# EAGLE design Twin_PLL_GPSDO (EAGLE 6.2)

## Sheet 1 of 3: Interface
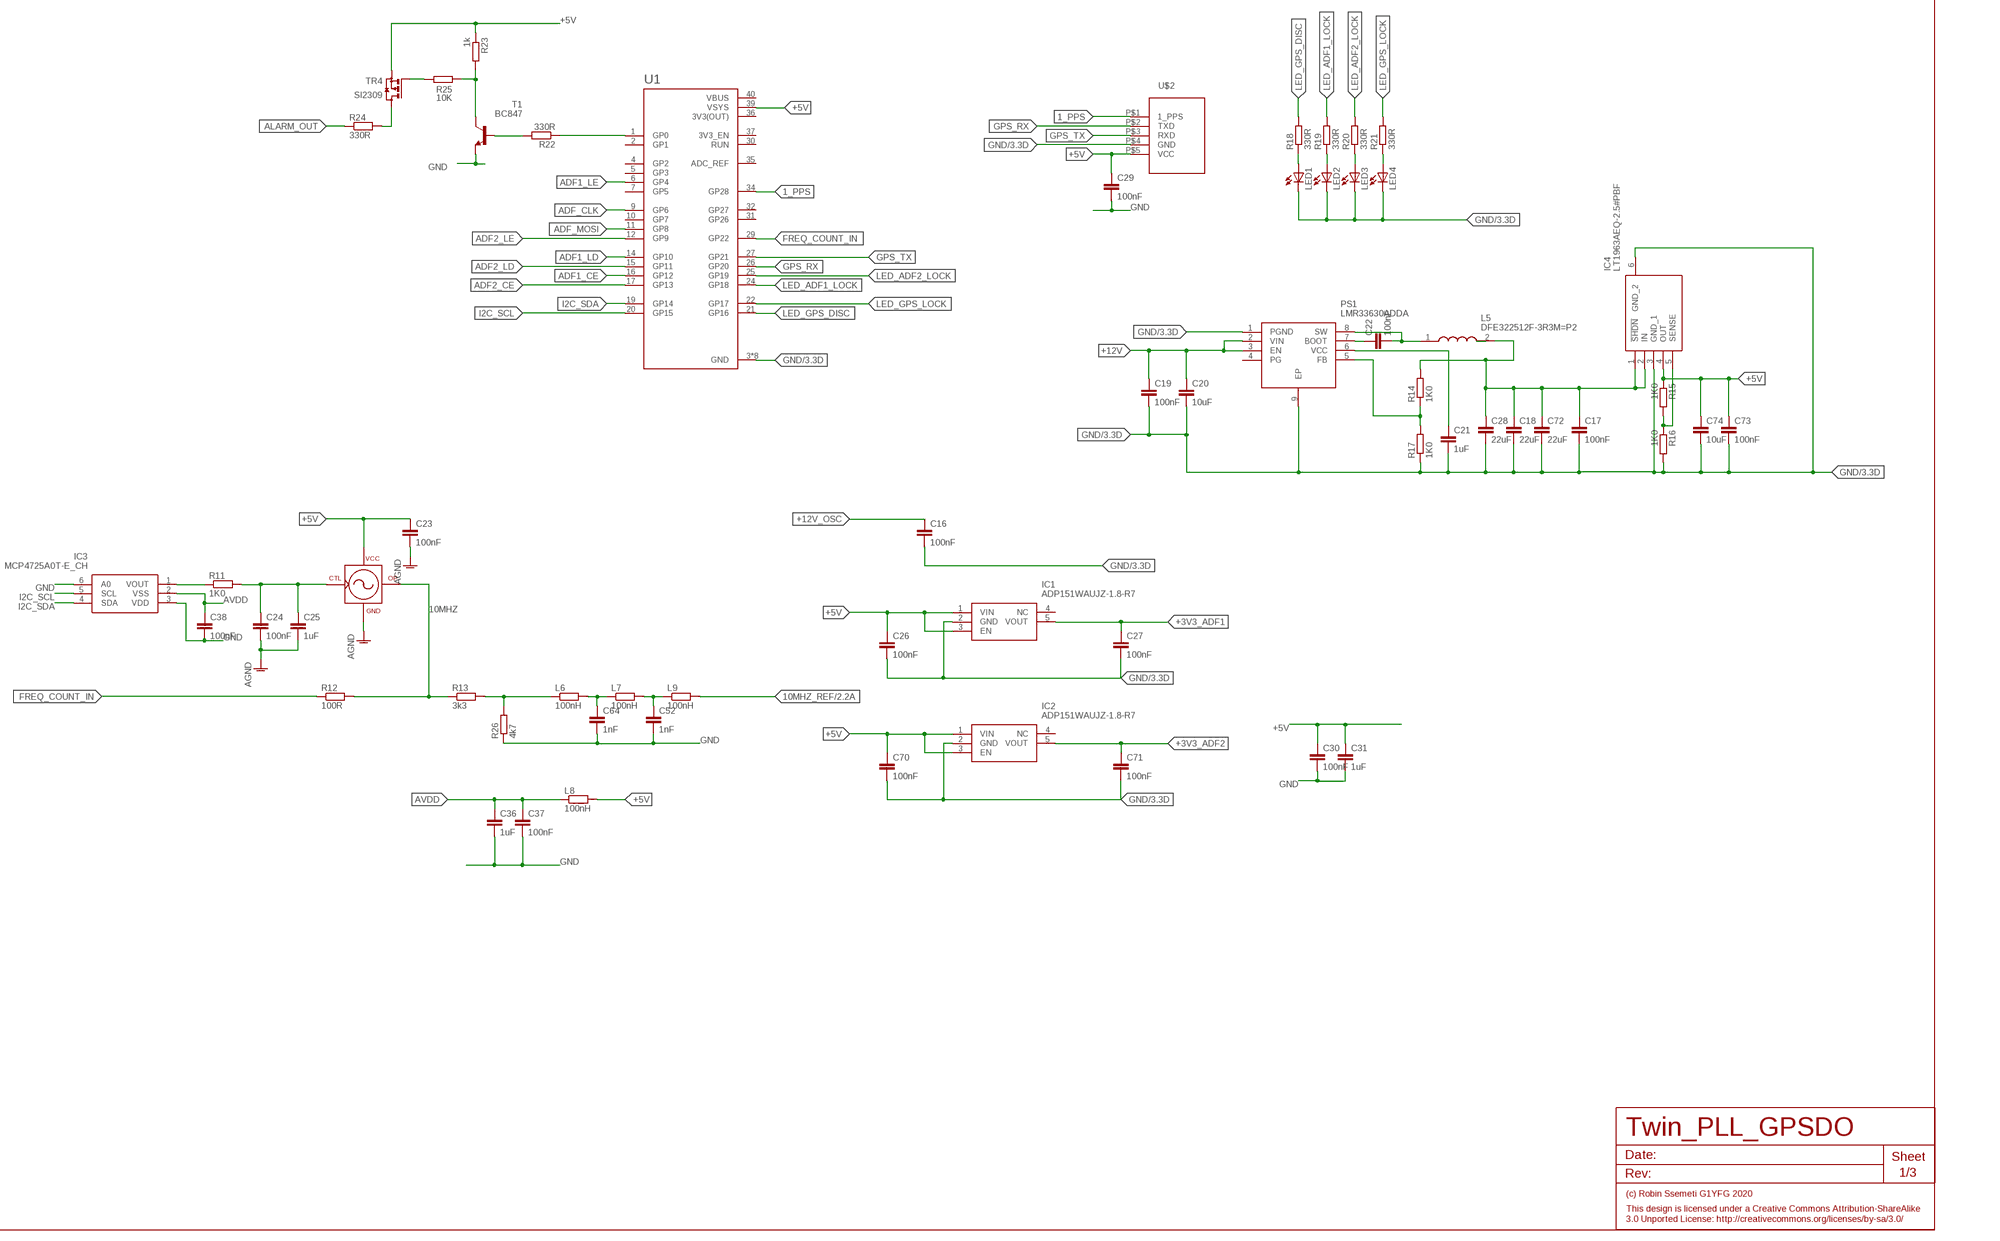
[diagram p0: schematic, sheet 1]

### Parts
C16  100nF  C-EUC0805  [C0805]
C17  100nF  C-EUC0805  [C0805]
C18  22uF  C-EUC1210  [C1210]
C19  100nF  C-EUC0805  [C0805]
C20  10uF  C-EUC0805  [C0805]
C21  1uF  C-EUC0805  [C0805]
C22  100nF  C-EUC0805  [C0805]
C23  100nF  C-EUC0603  [C0603]
C24  100nF  C-EUC0603  [C0603]
C25  1uF  C-EUC0603  [C0603]
C26  100nF  C-EUC0805  [C0805]
C27  100nF  C-EUC0805  [C0805]
C28  22uF  C-EUC1210  [C1210]
C29  100nF  C-EUC0805  [C0805]
C30  100nF  C-EUC0603  [C0603]
C31  1uF  C-EUC0603  [C0603]
C36  1uF  C-EUC0603  [C0603]
C37  100nF  C-EUC0603  [C0603]
C38  100nF  C-EUC0603  [C0603]
C52  1nF  C-EUC0603  [C0603]
C64  1nF  C-EUC0603  [C0603]
C70  100nF  C-EUC0805  [C0805]
C71  100nF  C-EUC0805  [C0805]
C72  22uF  C-EUC1210  [C1210]
C73  100nF  C-EUC0805  [C0805]
C74  10uF  C-EUC0805  [C0805]
IC1  ADP151WAUJZ-1.8-R7  [SOT95P280X100-5N]
IC2  ADP151WAUJZ-1.8-R7  [SOT95P280X100-5N]
IC3  MCP4725A0T-E_CH  [SOT95P270X145-6N]
IC4  LT1963AEQ-2.5#PBF  [LT1963AEQ25PBF]
L5  DFE322512F-3R3M=P2  [1277ASH100MP2]
L6  100nH  R-EU_R0603  [R0603]
L7  100nH  R-EU_R0603  [R0603]
L8  100nH  R-EU_R0603  [R0603]
L9  100nH  R-EU_R0603  [R0603]
LED1  LEDCHIPLED_0603  [CHIPLED_0603]
LED2  LEDCHIPLED_0603  [CHIPLED_0603]
LED3  LEDCHIPLED_0603  [CHIPLED_0603]
LED4  LEDCHIPLED_0603  [CHIPLED_0603]
OSC1  CTI_OSC  [CTI_OSC]
PS1  LMR33630ADDA  [SOIC127P600X170-9N]
R11  1K0  R-EU_R0805  [R0805]
R12  100R  R-EU_R0805  [R0805]
R13  3k3  R-EU_R0603  [R0603]
R14  1K0  R-EU_R0805  [R0805]
R15  1K0  R-EU_R0805  [R0805]
R16  1K0  R-EU_R0805  [R0805]
R17  1K0  R-EU_R0805  [R0805]
R18  330R  R-EU_R0603  [R0603]
R19  330R  R-EU_R0603  [R0603]
R20  330R  R-EU_R0603  [R0603]
R21  330R  R-EU_R0603  [R0603]
R22  330R  R-EU_R0603  [R0603]
R23  1k  R-EU_R0603  [R0603]
R24  330R  R-EU_R0805  [R0805]
R25  10K  R-EU_R0805  [R0805]
R26  4k7  R-EU_R0603  [R0603]
T1  BC847  [SOT23]
TR4  SI2309  BSS84  [SOT23]
U1  RASPBERRY_PICO-NO_DEBUGTH  [PICO-PKG-TH-STD]
U$2  GPS  [GPS]

### Nets
1_PPS: U1.34(GP28) U$2.P$1(1_PPS)
10MHZ: OSC1.OUT(OP) R12.2 R13.1
10MHZ_REF: L9.2 ; also sheet 2,3
+3V3_ADF1: C27.1 IC1.5(VOUT) ; also sheet 2
+3V3_ADF2: C71.1 IC2.5(VOUT) ; also sheet 3
+5V: C23.1 C26.1 C29.1 C30.1 C31.1 C70.1 C73.1 C74.1 IC1.1(VIN) IC1.3(EN) IC2.1(VIN) IC2.3(EN) IC4.4(OUT) L8.2 OSC1.VCC R15.1 R23.1 TR4.2(S) U1.39(VSYS) U$2.P$5(VCC)
+12V: C19.1 C20.1 PS1.2(VIN) PS1.3(EN)
+12V_OSC [PWR]: C16.1
ADF1_CE: U1.16(GP12) ; also sheet 2
ADF1_LD: U1.14(GP10) ; also sheet 2
ADF1_LE: U1.6(GP4) ; also sheet 2
ADF2_CE: U1.17(GP13) ; also sheet 3
ADF2_LD: U1.15(GP11) ; also sheet 3
ADF2_LE: U1.12(GP9) ; also sheet 3
ADF_CLK: U1.9(GP6) ; also sheet 2,3
ADF_MOSI: U1.11(GP8) ; also sheet 2,3
ALARM_OUT: R24.1
ALARM_PIN: R22.1 U1.1(GP0)
AVDD: C36.1 C37.1 C38.1 IC3.2(VSS) L8.1
FREQ_COUNT_IN: R12.1 U1.29(GP22)
GND: C16.2 C17.2 C18.2 C19.2 C20.2 C21.2 C23.2 C24.2 C25.2 C26.2 C27.2 C28.2 C29.2 C30.2 C31.2 C36.2 C37.2 C38.2 C52.2 C64.2 C70.2 C71.2 C72.2 C73.2 C74.2 IC1.2(GND) IC2.2(GND) IC3.3(VDD) IC3.6(A0) IC4.3(GND_1) IC4.6(GND_2) LED1.C LED2.C LED3.C LED4.C OSC1.GND PS1.1(PGND) PS1.9(EP) R16.2 R17.1 R26.1 T1.2(E) U1.3(GND) U1.8(GND) U1.13(GND) U1.18(GND) U1.23(GND) U1.28(GND) U1.33(GND) U1.38(GND) U$2.P$4(GND) ; supply symbol labelled AGND ; also sheet 2,3
GPS_RX: U1.26(GP20) U$2.P$2(TXD)
GPS_TX: U1.27(GP21) U$2.P$3(RXD)
I2C_SCL: IC3.5(SCL) U1.20(GP15)
I2C_SDA: IC3.4(SDA) U1.19(GP14)
LED_ADF1_LOCK: R19.2 U1.24(GP18)
LED_ADF2_LOCK: R20.2 U1.25(GP19)
LED_GPS_DISC: R18.2 U1.21(GP16)
LED_GPS_LOCK: R21.2 U1.22(GP17)
N$20: IC3.1(VOUT) R11.1
N$21: R23.2 R25.2 T1.3(C)
N$26: L6.1 R13.2 R26.2
N$27: LED1.A R18.1
N$28: R22.2 T1.1(B)
N$29: IC4.5(SENSE) R15.2 R16.1
N$31: PS1.5(FB) R14.1 R17.2
N$32: C24.1 C25.1 OSC1.REF(CTRL) R11.2
N$33: C21.1 PS1.6(VCC)
N$34: C22.1 PS1.7(BOOT)
N$35: C22.2 L5.1 PS1.8(SW)
N$36: C17.1 C18.1 C28.1 C72.1 IC4.1(!SHDN) IC4.2(IN) L5.2 R14.2
N$37: LED2.A R19.1
N$38: LED3.A R20.1
N$39: LED4.A R21.1
N$41: C64.1 L6.2 L7.1
N$42: R25.1 TR4.1(G)
N$43: C52.1 L7.2 L9.1
SWITCH: R24.2 TR4.3(D)
Unconnected: IC1.4(NC) IC2.4(NC) PS1.4(PG) U1.2(GP1) U1.4(GP2) U1.5(GP3) U1.7(GP5) U1.10(GP7) U1.30(RUN) U1.31(GP26) U1.32(GP27) U1.35(ADC_REF) U1.37(3V3_EN)

## Sheet 2 of 3
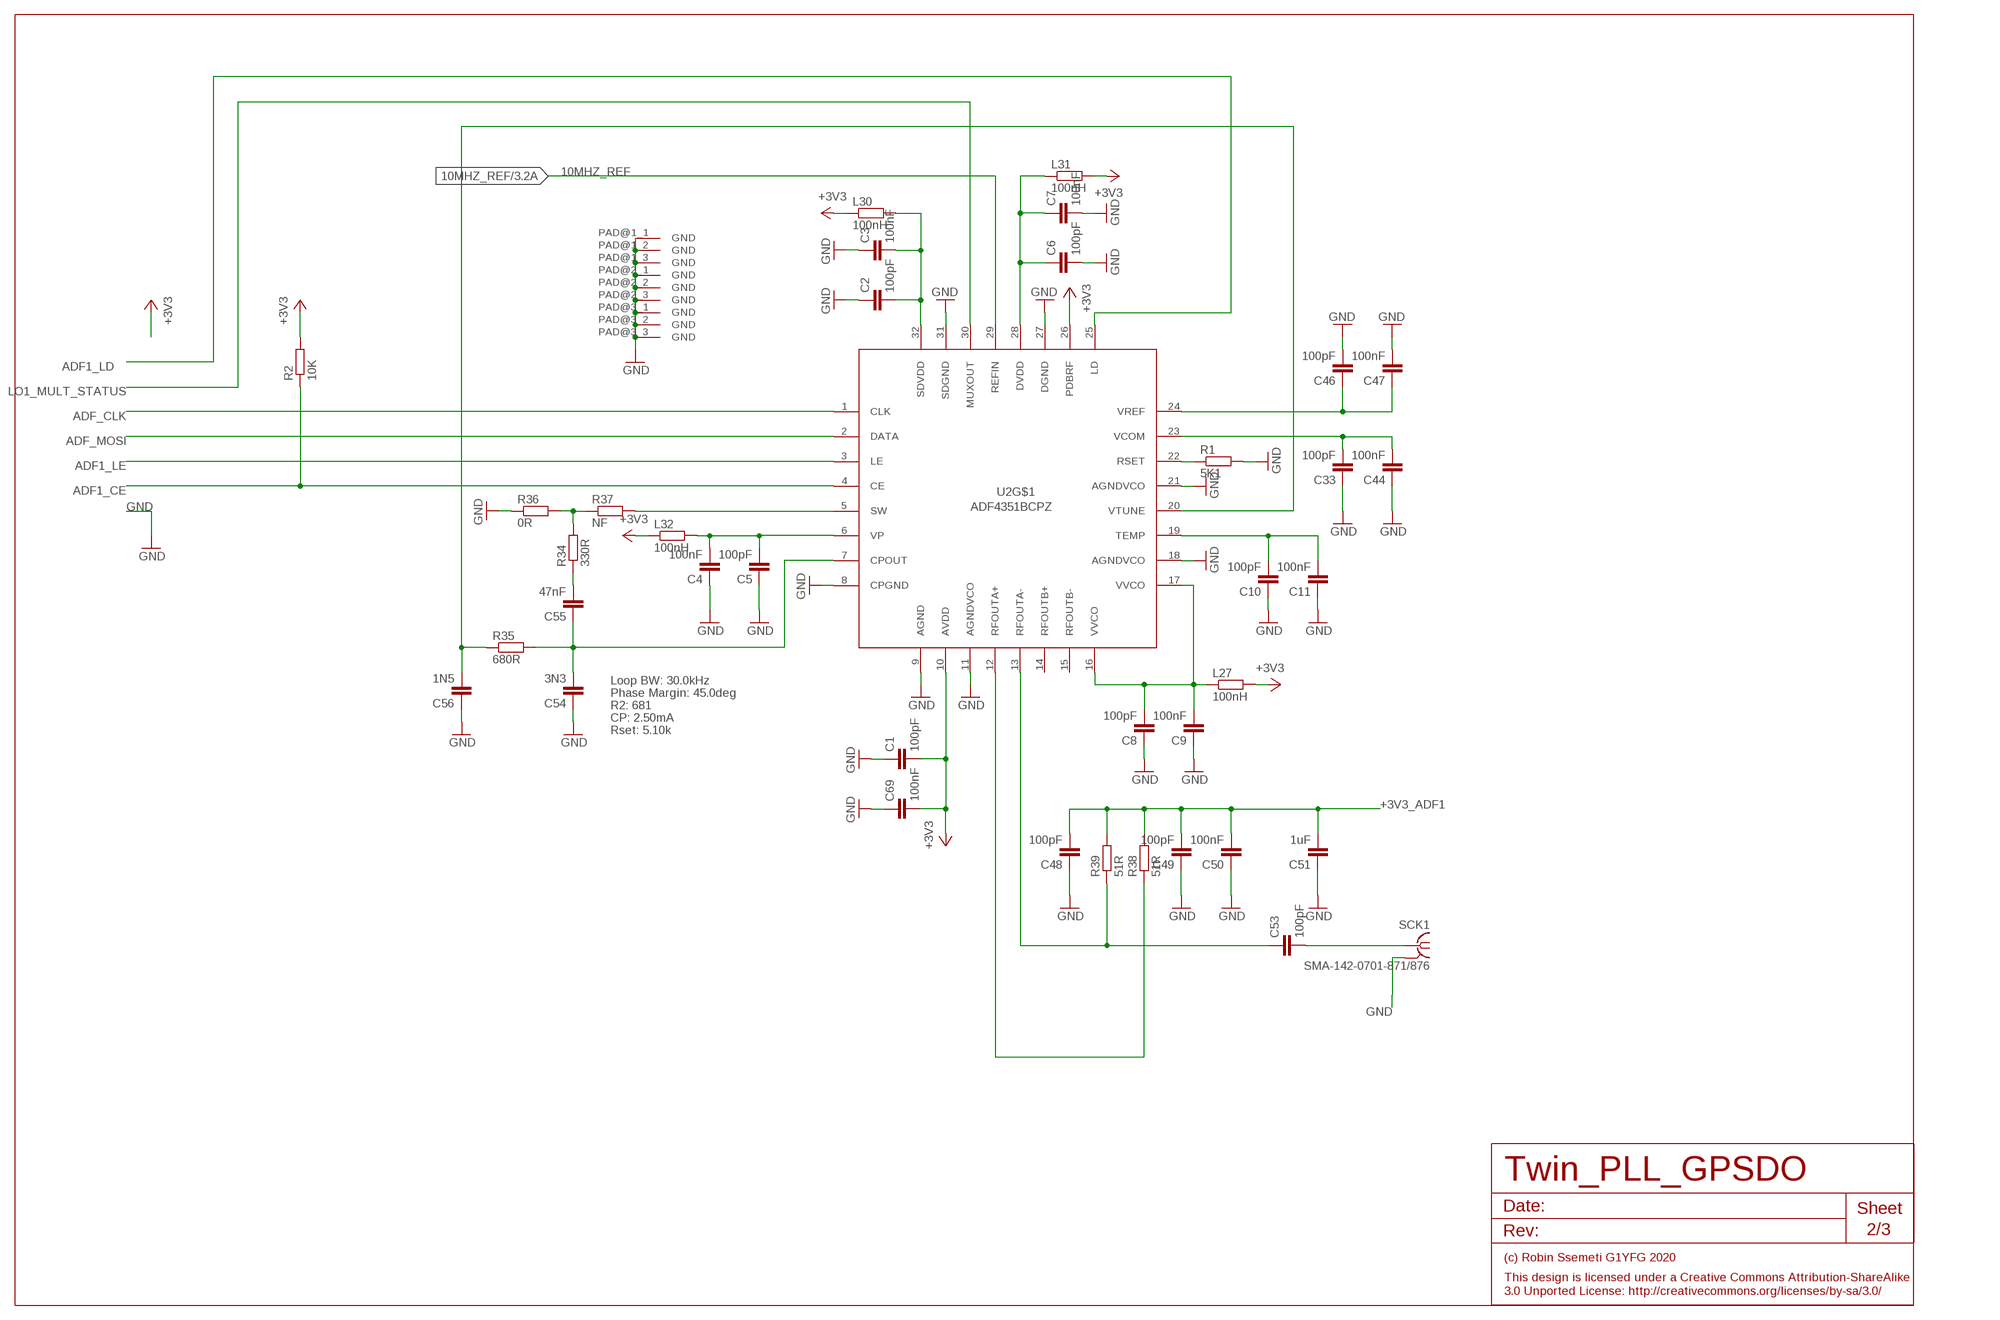
[diagram p1: schematic, sheet 2]

### Parts
C1  100pF  C-EUC0603  [C0603]
C2  100pF  C-EUC0603  [C0603]
C3  100nF  C-EUC0603  [C0603]
C4  100nF  C-EUC0603  [C0603]
C5  100pF  C-EUC0603  [C0603]
C6  100pF  C-EUC0603  [C0603]
C7  100nF  C-EUC0603  [C0603]
C8  100pF  C-EUC0603  [C0603]
C9  100nF  C-EUC0603  [C0603]
C10  100pF  C-EUC0603  [C0603]
C11  100nF  C-EUC0603  [C0603]
C33  100pF  C-EUC0603  [C0603]
C44  100nF  C-EUC0603  [C0603]
C46  100pF  C-EUC0603  [C0603]
C47  100nF  C-EUC0603  [C0603]
C48  100pF  C-EUC0603  [C0603]
C49  100pF  C-EUC0603  [C0603]
C50  100nF  C-EUC0603  [C0603]
C51  1uF  C-EUC0603  [C0603]
C53  100pF  C-EUC0603  [C0603]
C54  3N3  C-EUC0603  [C0603]
C55  47nF  C-EUC0603  [C0603]
C56  1N5  C-EUC0603  [C0603]
C69  100nF  C-EUC0603  [C0603]
L27  100nH  R-EU_R0603  [R0603]
L30  100nH  R-EU_R0603  [R0603]
L31  100nH  R-EU_R0603  [R0603]
L32  100nH  R-EU_R0603  [R0603]
R1  5K1  R-EU_R0603  [R0603]
R2  10K  R-EU_R0603  [R0603]
R34  330R  R-EU_R0603  [R0603]
R35  680R  R-EU_R0603  [R0603]
R36  0R  R-EU_R0603  [R0603]
R37  NF  R-EU_R0603  [R0603]
R38  51R  R-EU_R0603  [R0603]
R39  51R  R-EU_R0603  [R0603]
SCK1  SMA-142-0701-871/876  [J502-ND-142-0701-871/876]
U2  ADF4351BCPZ  ADF4350BCPZ  [QFN50P500X500X100-33V2N]

### Nets
10MHZ_REF: U2.29(REFIN) ; also sheet 1,3
+3V3_ADF1: C1.2 C48.2 C49.2 C50.2 C51.2 C69.2 L27.2 L30.1 L31.2 L32.1 R2.2 R38.2 R39.2 U2.10(AVDD) U2.26(PDBRF) ; supply symbol labelled +3V3 ; also sheet 1
ADF1_CE: R2.1 U2.4(CE) ; also sheet 1
ADF1_LD: U2.25(LD) ; also sheet 1
ADF1_LE: U2.3(LE) ; also sheet 1
ADF_CLK: U2.1(CLK) ; also sheet 1,3
ADF_MOSI: U2.2(DATA) ; also sheet 1,3
GND: C1.1 C2.1 C3.1 C4.1 C5.1 C6.2 C7.2 C8.1 C9.1 C10.1 C11.1 C33.1 C44.1 C46.2 C47.2 C48.1 C49.1 C50.1 C51.1 C54.1 C56.1 C69.1 R1.2 R36.1 SCK1.G@1(GND) U2.8(CPGND) U2.9(AGND) U2.11(AGNDVCO) U2.18(AGNDVCO) U2.21(AGNDVCO) U2.27(DGND) U2.31(SDGND) U2.PAD@1_1(GND) U2.PAD@1_2(GND) U2.PAD@1_3(GND) U2.PAD@2_1(GND) U2.PAD@2_2(GND) U2.PAD@2_3(GND) U2.PAD@3_1(GND) U2.PAD@3_2(GND) U2.PAD@3_3(GND) ; also sheet 1,3
LO1_MULT_STATUS: U2.30(MUXOUT)
N$2: C10.2 C11.2 U2.19(TEMP)
N$4: C33.2 C44.2 U2.23(VCOM)
N$8: C46.1 C47.1 U2.24(VREF)
N$13: C4.2 C5.2 L32.2 U2.6(VP)
N$14: C2.2 C3.2 L30.2 U2.32(SDVDD)
N$17: R1.1 U2.22(RSET)
N$18: R38.1 U2.12(RFOUTA+)
N$19: C53.1 R39.1 U2.13(RFOUTA-)
N$46: C54.2 C55.1 R35.2 U2.7(CPOUT)
N$47: C56.2 R35.1 U2.20(VTUNE)
N$48: C55.2 R34.1
N$49: R34.2 R36.2 R37.1
N$50: R37.2 U2.5(SW)
N$73: C6.1 C7.1 L31.1 U2.28(DVDD)
N$78: C8.2 C9.2 L27.1 U2.16(VVCO) U2.17(VVCO)
N$101 [50ohm]: C53.2 SCK1.1
Unconnected: U2.14(RFOUTB+) U2.15(RFOUTB-)

### Notes on the sheet
- Loop BW: 30.0kHz
- Phase Margin: 45.0deg
- R2: 681
- CP: 2.50mA
- Rset: 5.10k

## Sheet 3 of 3
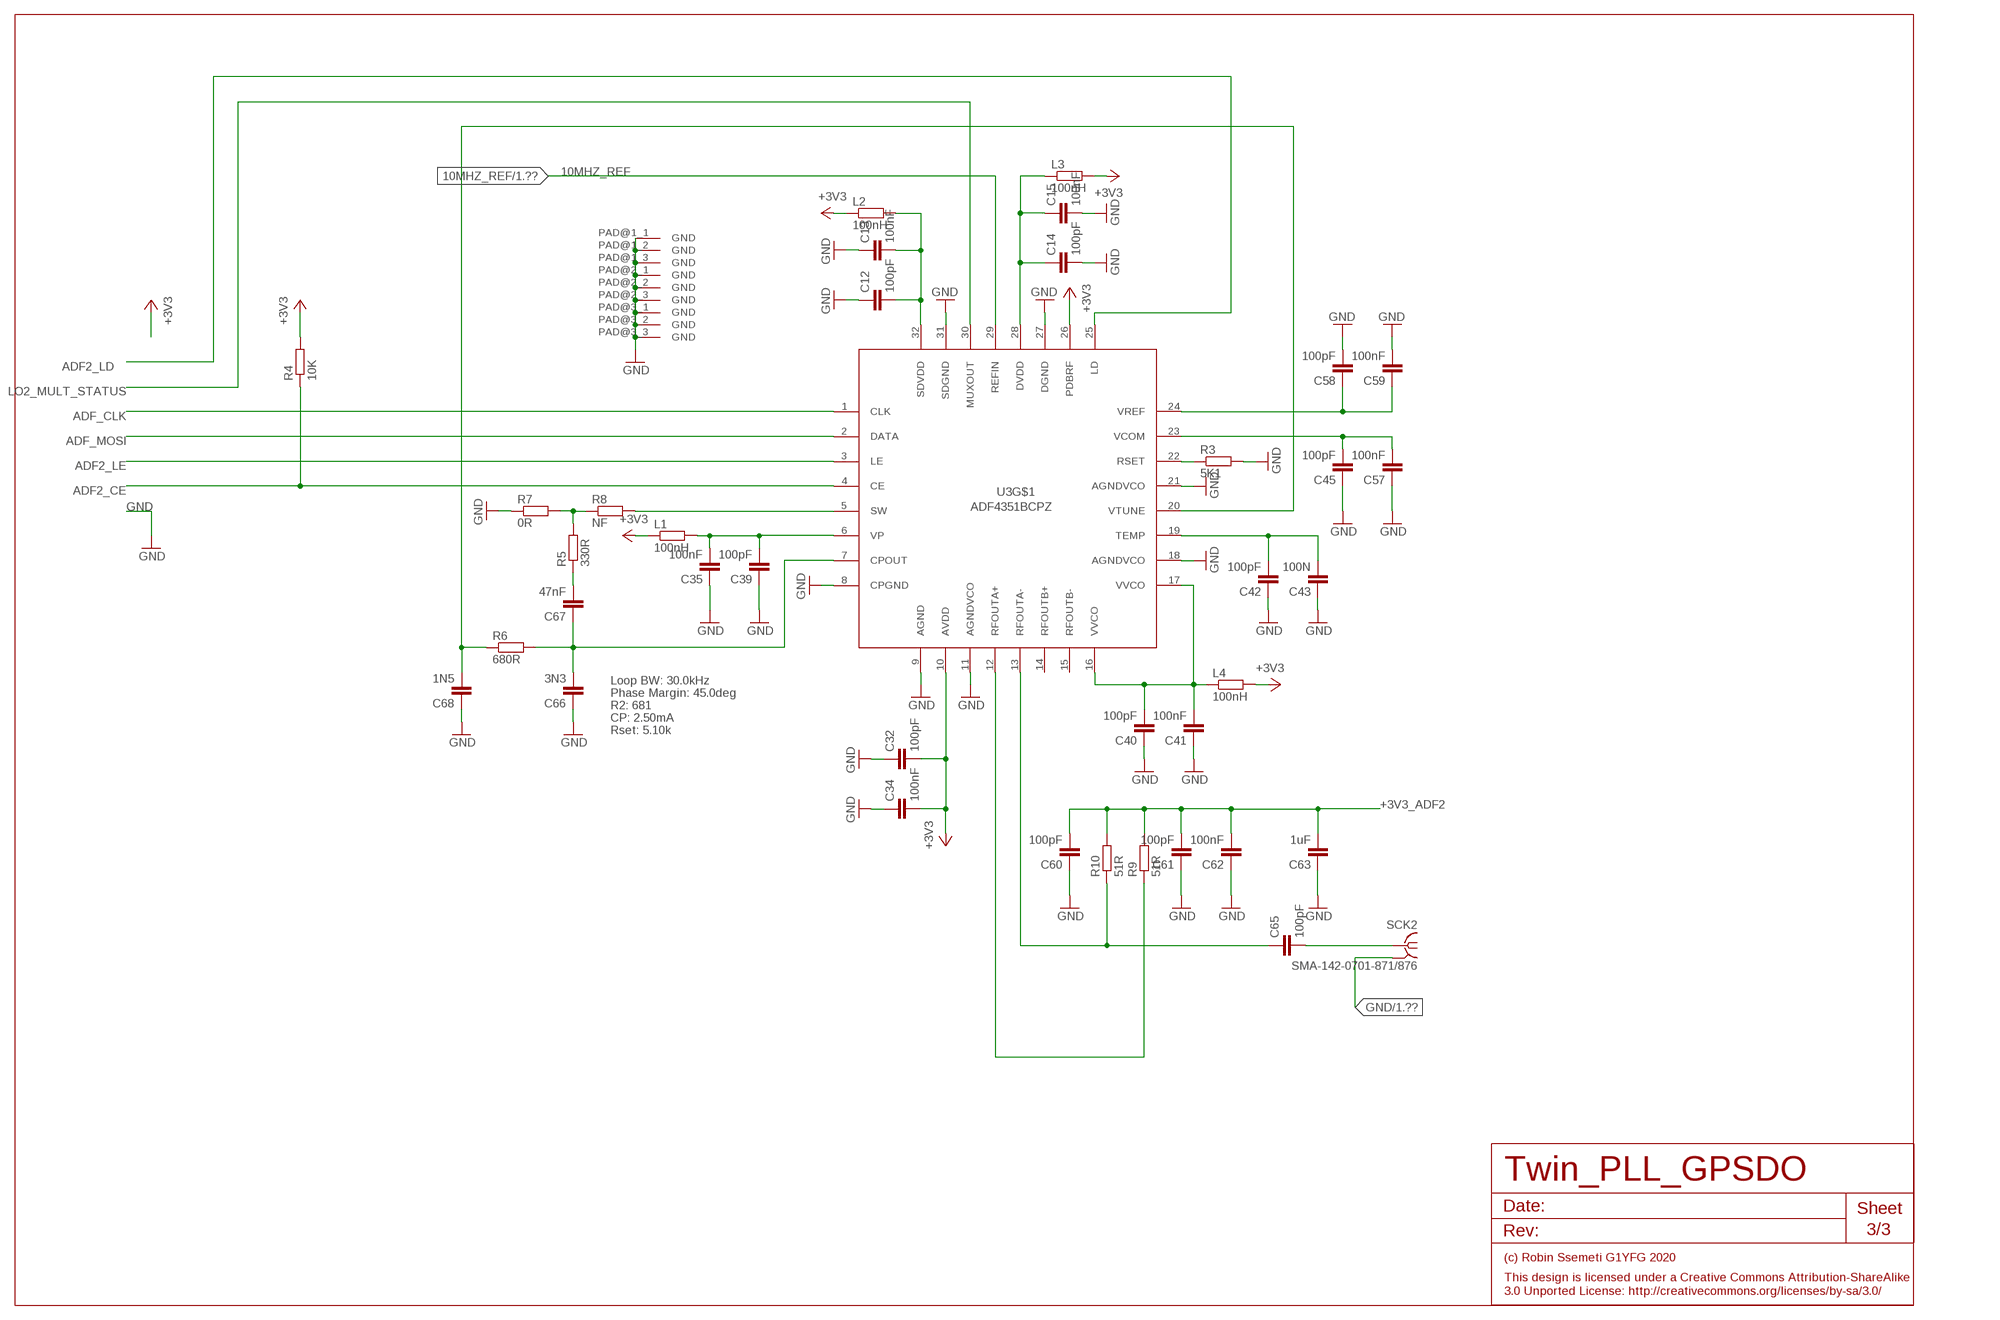
[diagram p2: schematic, sheet 3]

### Parts
C12  100pF  C-EUC0603  [C0603]
C13  100nF  C-EUC0603  [C0603]
C14  100pF  C-EUC0603  [C0603]
C15  100nF  C-EUC0603  [C0603]
C32  100pF  C-EUC0603  [C0603]
C34  100nF  C-EUC0603  [C0603]
C35  100nF  C-EUC0603  [C0603]
C39  100pF  C-EUC0603  [C0603]
C40  100pF  C-EUC0603  [C0603]
C41  100nF  C-EUC0603  [C0603]
C42  100pF  C-EUC0603  [C0603]
C43  100N  C-EUC0603  [C0603]
C45  100pF  C-EUC0603  [C0603]
C57  100nF  C-EUC0603  [C0603]
C58  100pF  C-EUC0603  [C0603]
C59  100nF  C-EUC0603  [C0603]
C60  100pF  C-EUC0603  [C0603]
C61  100pF  C-EUC0603  [C0603]
C62  100nF  C-EUC0603  [C0603]
C63  1uF  C-EUC0603  [C0603]
C65  100pF  C-EUC0603  [C0603]
C66  3N3  C-EUC0603  [C0603]
C67  47nF  C-EUC0603  [C0603]
C68  1N5  C-EUC0603  [C0603]
L1  100nH  R-EU_R0603  [R0603]
L2  100nH  R-EU_R0603  [R0603]
L3  100nH  R-EU_R0603  [R0603]
L4  100nH  R-EU_R0603  [R0603]
R3  5K1  R-EU_R0603  [R0603]
R4  10K  R-EU_R0603  [R0603]
R5  330R  R-EU_R0603  [R0603]
R6  680R  R-EU_R0603  [R0603]
R7  0R  R-EU_R0603  [R0603]
R8  NF  R-EU_R0603  [R0603]
R9  51R  R-EU_R0603  [R0603]
R10  51R  R-EU_R0603  [R0603]
SCK2  SMA-142-0701-871/876  [J502-ND-142-0701-871/876]
U3  ADF4351BCPZ  ADF4350BCPZ  [QFN50P500X500X100-33V2N]

### Nets
10MHZ_REF: U3.29(REFIN) ; also sheet 1,2
+3V3_ADF2: C32.2 C34.2 C60.2 C61.2 C62.2 C63.2 L1.1 L2.1 L3.2 L4.2 R4.2 R9.2 R10.2 U3.10(AVDD) U3.26(PDBRF) ; supply symbol labelled +3V3 ; also sheet 1
ADF2_CE: R4.1 U3.4(CE) ; also sheet 1
ADF2_LD: U3.25(LD) ; also sheet 1
ADF2_LE: U3.3(LE) ; also sheet 1
ADF_CLK: U3.1(CLK) ; also sheet 1,2
ADF_MOSI: U3.2(DATA) ; also sheet 1,2
GND: C12.1 C13.1 C14.2 C15.2 C32.1 C34.1 C35.1 C39.1 C40.1 C41.1 C42.1 C43.1 C45.1 C57.1 C58.2 C59.2 C60.1 C61.1 C62.1 C63.1 C66.1 C68.1 R3.2 R7.1 SCK2.G@1(GND) U3.8(CPGND) U3.9(AGND) U3.11(AGNDVCO) U3.18(AGNDVCO) U3.21(AGNDVCO) U3.27(DGND) U3.31(SDGND) U3.PAD@1_1(GND) U3.PAD@1_2(GND) U3.PAD@1_3(GND) U3.PAD@2_1(GND) U3.PAD@2_2(GND) U3.PAD@2_3(GND) U3.PAD@3_1(GND) U3.PAD@3_2(GND) U3.PAD@3_3(GND) ; also sheet 1,2
LO2_MULT_STATUS: U3.30(MUXOUT)
N$1: C42.2 C43.2 U3.19(TEMP)
N$3: C45.2 C57.2 U3.23(VCOM)
N$5: C58.1 C59.1 U3.24(VREF)
N$6: R3.1 U3.22(RSET)
N$7: R9.1 U3.12(RFOUTA+)
N$9: C65.1 R10.1 U3.13(RFOUTA-)
N$10: C66.2 C67.1 R6.2 U3.7(CPOUT)
N$11: C68.2 R6.1 U3.20(VTUNE)
N$12: C67.2 R5.1
N$15: R5.2 R7.2 R8.1
N$16: R8.2 U3.5(SW)
N$22: C35.2 C39.2 L1.2 U3.6(VP)
N$23: C12.2 C13.2 L2.2 U3.32(SDVDD)
N$24: C14.1 C15.1 L3.1 U3.28(DVDD)
N$25: C40.2 C41.2 L4.1 U3.16(VVCO) U3.17(VVCO)
OUTPUT: C65.2 SCK2.1
Unconnected: U3.14(RFOUTB+) U3.15(RFOUTB-)

### Notes on the sheet
- Loop BW: 30.0kHz
- Phase Margin: 45.0deg
- R2: 681
- CP: 2.50mA
- Rset: 5.10k

## Power pins joined to a net without a drawn wire
3V3(OUT): U1.36(3V3(OUT))
GND: SCK1.G@2(GND) SCK1.G@3(GND) SCK1.G@4(GND) SCK2.G@2(GND) SCK2.G@3(GND) SCK2.G@4(GND)
VBUS: U1.40(VBUS)

## Library data of the parts
C1-C17 C19-C27 C29 C32-C35 C38-C51 C53-C63 C65-C71 C73 C74 = rcl:C-EU: CAPACITOR, European symbol
C18 C28 C30 C31 C36 C37 C52 C64 C72 = resistor:C-EU: CAPACITOR, European symbol
IC1 IC2 = ADP151WAUJZ-1.8-R7:ADP151WAUJZ-1.8-R7: LDO Voltage Regulators Ultra-Low Noise 200mA LDO Source: Datasheet <https://www.analog.com/media/en/technical-documentation/data-sheets/adp151.pdf>; DESCRIPTION: LDO Voltage Regulators Ultra-Low Noise 200mA LDO; HEIGHT: 1mm; MANUFACTURER_NAME: Analog Devices; MANUFACTURER_PART_NUMBER: ADP151WAUJZ-1.8-R7; MOUSER_PART_NUMBER: 584-P151WAUJZ-1.8-R7; MOUSER_PRICE-STOCK: https://www.mouser.co.uk/ProductDetail/Analog-Devices/ADP151WAUJZ-1.8-R7?qs=pUKx8fyJudBq6xBHJodQww%3D%3D
IC3 = MCP4725A0T-E_CH:MCP4725A0T-E_CH: D/A Converter 12-Bit EEPROM I2C SOT23-6 Source: Datasheet <http://ww1.microchip.com/downloads/en/DeviceDoc/22039d.pdf>; DESCRIPTION: D/A Converter 12-Bit EEPROM I2C SOT23-6; HEIGHT: 1.45mm; MANUFACTURER_NAME: Microchip; MANUFACTURER_PART_NUMBER: MCP4725A0T-E/CH; MOUSER_PART_NUMBER: 579-MCP4725A0TECH; MOUSER_PRICE-STOCK: https://www.mouser.co.uk/ProductDetail/Microchip-Technology/MCP4725A0T-E-CH?qs=vkMqrgFpRajeQECZ3goc0A%3D%3D
IC4 = LT1963AEQ-2.5#PBF:LT1963AEQ-2.5#PBF: LDO Voltage Regulators Fast Transient 1.5A LDO Source: Datasheet <https://www.analog.com/media/en/technical-documentation/data-sheets/1963aff.pdf>; ARROW_PART_NUMBER: LT1963AEQ-2.5#PBF; ARROW_PRICE-STOCK: https://www.arrow.com/en/products/lt1963aeq-2.5pbf/analog-devices?region=nac; DESCRIPTION: LDO Voltage Regulators Fast Transient 1.5A LDO; HEIGHT: 4.877mm; MANUFACTURER_NAME: Analog Devices; MANUFACTURER_PART_NUMBER: LT1963AEQ-2.5#PBF; MOUSER_PART_NUMBER: 584-LT1963AEQ-2.5PBF; MOUSER_PRICE-STOCK: https://www.mouser.co.uk/ProductDetail/Analog-Devices/LT1963AEQ-2.5PBF?qs=ytflclh7QUVL4eYkr0WUyA%3D%3D
L1-L4 L27 L30-L32 R1 R3 R5 R7 R8 R34 R36 R37 = rcl:R-EU_: RESISTOR, European symbol
L5 = DFE322512F-3R3M=P2:DFE322512F-3R3M=P2: DFE322512F Series Inductor 3.3uH +/-20% 1210 (3225) Source: Datasheet <https://search.murata.co.jp/Ceramy/image/img/P02/J(E)TE243A-0019.pdf>; ARROW_PART_NUMBER: DFE322512F-3R3M=P2; ARROW_PRICE-STOCK: https://www.arrow.com/en/products/dfe322512f-3r3mp2/murata-manufacturing?utm_currency=USD&region=nac; DESCRIPTION: DFE322512F Series Inductor 3.3uH +/-20% 1210 (3225); FARNELL_OC: 2871467; HEIGHT: 1.2mm; MANUFACTURER_NAME: Murata Electronics; MANUFACTURER_PART_NUMBER: DFE322512F-3R3M=P2; MOUSER_PART_NUMBER: 81-DFE322512F-3R3MP2; MOUSER_PRICE-STOCK: https://www.mouser.co.uk/ProductDetail/Murata-Electronics/DFE322512F-3R3M%3dP2?qs=AQlKX63v8Rs49LX98%2FUyBA%3D%3D
L6-L9 R2 R4 R6 R9-R24 R26 R35 R38 R39 = resistor:R-EU_: RESISTOR, European symbol
LED1-LED4 = led:LED: LED OSRAM: - CHIPLED LG R971, LG N971, LY N971, LG Q971, LY Q971, LO R971, LY R971 LH N974, LH R974 LS Q976, LO Q976, LY Q976 LO Q996 - Hyper CHIPLED LW Q18S LB Q993, LB Q99A, LB R99A - SideLED LS A670, LO A670, LY A670, LG A670, LP A670 LB A673, LV A673, LT A673, LW A673 LH A674 LY A675 LS A676, LA A676, LO A676, LY A676, LW A676 LS A679, LY A679, LG A679 - Hyper Micro SIDELED® LS Y876, LA Y876, LO Y876, LY Y876 LT Y87S - SmartLED LW L88C, LW L88S LB L89C, LB L89S, LG L890 LS L89K, LO L89K, LY L89K LS L896, LA L896, LO L896, LY L896 - TOPLED LS T670, LO T670, LY T670, LG T670, LP T670 LSG T670, LSP T670, LSY T670, LOP T670, LYG T670 LG T671, LOG T671, LSG T671 LB T673, LV T673, LT T673, LW T673 LH T674 LS T676, LA T676, LO T676, LY T676, LB T676, LH T676, LSB T676, LW T676 LB T67C, LV T67C, LT T67C, LS T67K, LO T67K, LY T67K, LW E67C LS E67B, LA E67B, LO E67B, LY E67B, LB E67C, LV E67C, LT E67C LW T67C LS T679, LY T679, LG T679 LS T770, LO T770, LY T770, LG T770, LP T770 LB T773, LV T773, LT T773, LW T773 LH T774 LS E675, LA E675, LY E675, LS T675 LS T776, LA T776, LO T776, LY T776, LB T776 LHGB T686 LT T68C, LB T68C - Hyper Mini TOPLED® LB M676 - Mini TOPLED Santana® LG M470 LS M47K, LO M47K, LY M47K Source: http://www.osram.convergy.de LUXEON: - LUMILED® LXK2-PW12-R00, LXK2-PW12-S00, LXK2-PW14-U00, LXK2-PW14-V00 LXK2-PM12-R00, LXK2-PM12-S00, LXK2-PM14-U00 LXK2-PE12-Q00, LXK2-PE12-R00, LXK2-PE12-S00, LXK2-PE14-T00, LXK2-PE14-U00 LXK2-PB12-K00, LXK2-PB12-L00, LXK2-PB12-M00, LXK2-PB14-N00, LXK2-PB14-P00, LXK2-PB14-Q00 LXK2-PR12-L00, LXK2-PR12-M00, LXK2-PR14-Q00, LXK2-PR14-R00 LXK2-PD12-Q00, LXK2-PD12-R00, LXK2-PD12-S00 LXK2-PH12-R00, LXK2-PH12-S00 LXK2-PL12-P00, LXK2-PL12-Q00, LXK2-PL12-R00 Source: www.luxeon.com KINGBRIGHT: KA-3528ASYC Source: www.kingbright.com
OSC1 = RF:CTI_OSC
PS1 = LMR33630ADDA:LMR33630ADDA: SIMPLE SWITCHER 3.8V to 36V, 3A Synchronous Buck Converter With Ultra-Low EMI Source: Datasheet <http://www.ti.com/lit/ds/symlink/lmr33630.pdf>; ARROW_PART_NUMBER: LMR33630ADDA; ARROW_PRICE-STOCK: https://www.arrow.com/en/products/lmr33630adda/texas-instruments.html?utm_currency=USD; DESCRIPTION: SIMPLE SWITCHER 3.8V to 36V, 3A Synchronous Buck Converter With Ultra-Low EMI; HEIGHT: 1.7mm; MANUFACTURER_NAME: Texas Instruments; MANUFACTURER_PART_NUMBER: LMR33630ADDA; MOUSER_PART_NUMBER: 595-LMR33630ADDA; MOUSER_PRICE-STOCK: https://www.mouser.co.uk/ProductDetail/Texas-Instruments/LMR33630ADDA?qs=r5DSvlrkXmL3yj62Sna%2FpQ%3D%3D
R25 = rcl:R-EU_: RESISTOR, European symbol; OC_FARNELL: unknown
SCK1 SCK2 = con-coax:SMA-: SMA 50 Ohm End Launch Jack Receptacle - Round Contact Johnson Components Source: www.johnsoncomponents.com .. J502-ND.pdf; MF: JOHNSON COMPONENTS; MPN: 142-0701-871; OC_FARNELL: 1339835; OC_NEWARK: 91B6105
T1 = transistor:BC847: NPN TRANSISTOR
TR4 = transistor-small-signal:BSS84: P-CHANNEL MOS FET
U1 = RpiPico:RASPBERRY_PICO-NO_DEBUG
U2 U3 = analog_devices:ADF4350
U$2 = gps:GPS

## Net classes
0 default: width 0.25 mm, drill 0.3 mm
1 50ohm: width 0.508 mm, clearance 0.762 mm
3 TG: clearance 0.2 mm

## Board
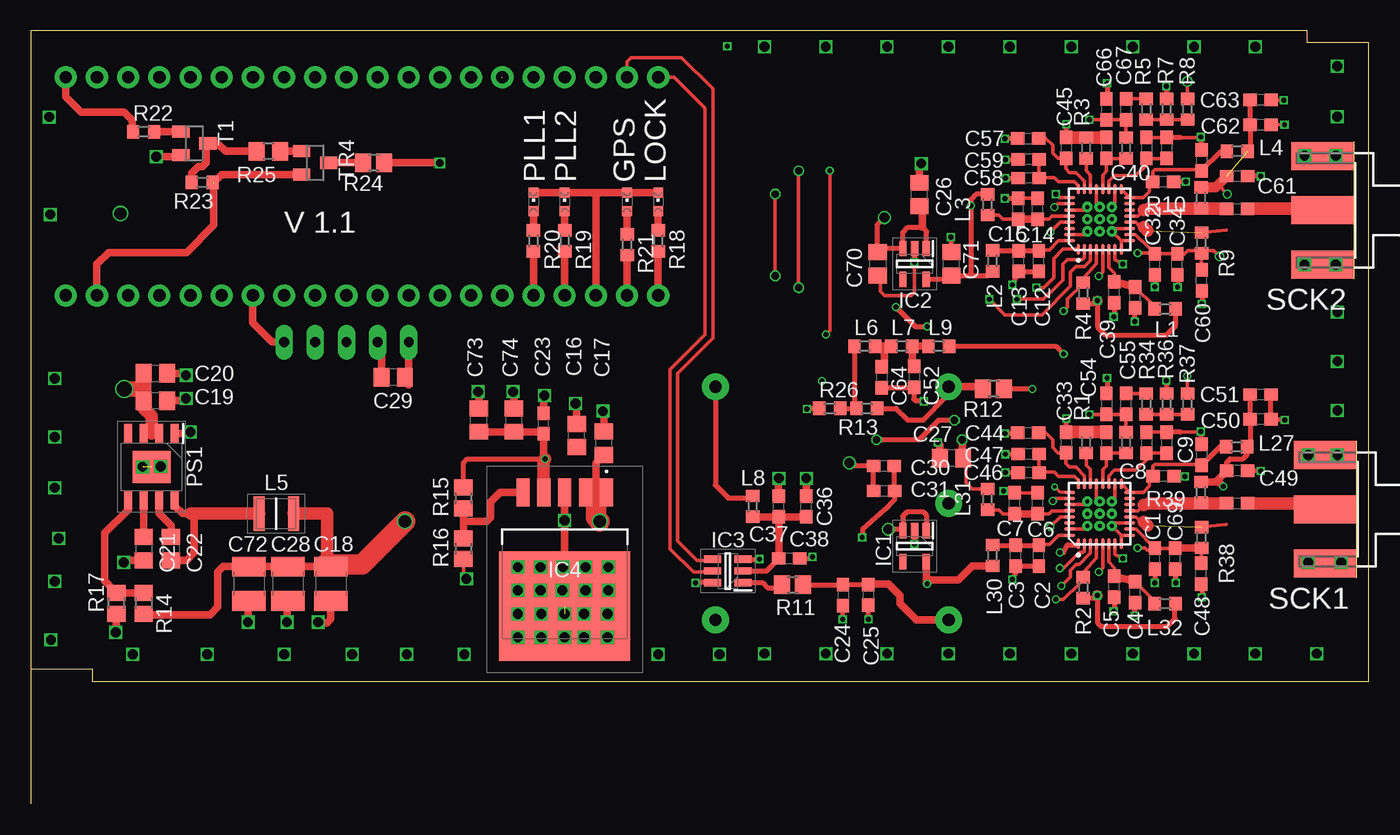
[diagram p3: board, top side]
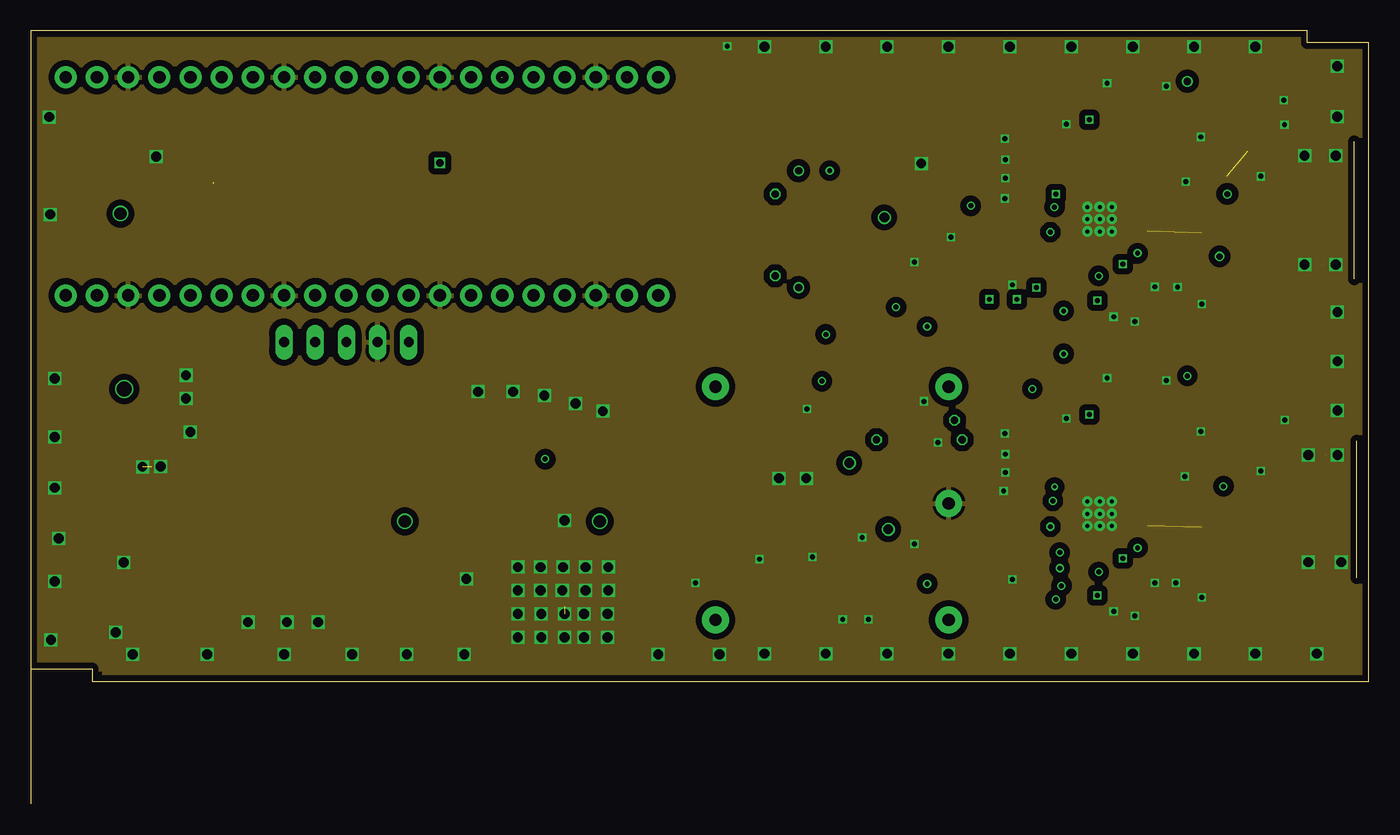
[diagram p4: board, inner layer RFEarth]
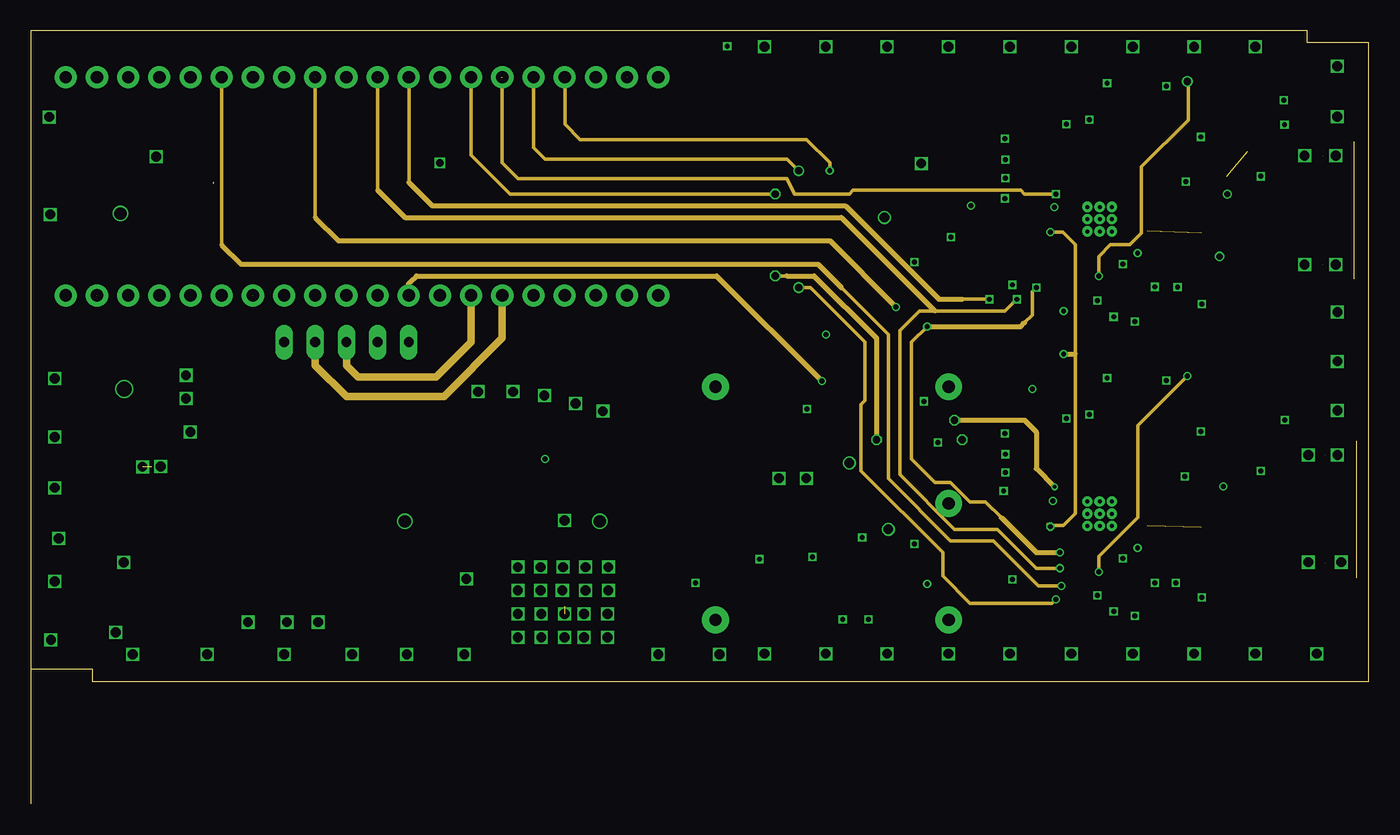
[diagram p5: board, inner layer Signal]
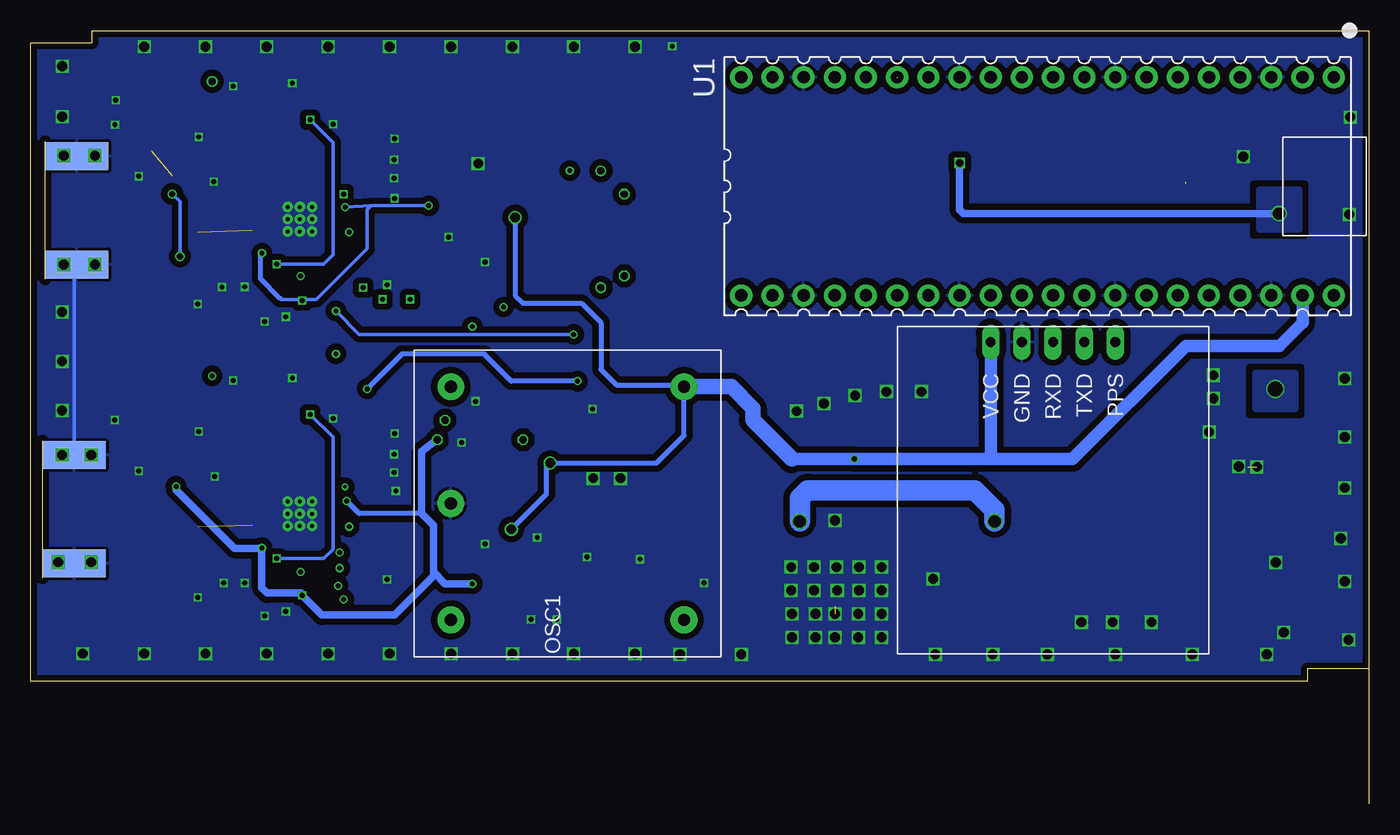
[diagram p6: board, bottom side, seen from below]

Size 109 x 63 mm. Coordinates in mm from the lower left corner, seen from the top.
Outline: 0,11 5,11 5,10 109,10 109,62 104,62 104,63 0,63 0,11
Outline: 0,11 0,0
Copper layers (1+2*15+16): Top 0.035mm / dielectric 0.2mm / RFEarth 0.0175mm / dielectric 1.065mm / Signal 0.0175mm / dielectric 0.2mm / Power 0.035mm
Design rules: minimum track width 3.5mil, minimum drill 0.2mm, track to track 5mil, track to pad 0.2mm, pad to pad 5mil, via to via 0.5mm, smd to smd 5mil, copper to edge 0.2mm, drill to drill 6mil, minimum pad ring 10mil, minimum via ring 0.13mm, stop-mask expansion 0.05mm, vias tented up to drill 16mil, thermal gap 10mil

### Footprints (pad centres in the part's own frame; a part is rotated, then mirrored left to right if it is on the bottom)
C0603 = smd 1.1 x 1: 1 -0.85,0; 2 0.85,0
C0805 = smd 1.3 x 1.5: 1 -0.95,0; 2 0.95,0
C1210 = smd 1.6 x 2.7: 1 -1.4,0; 2 1.4,0
SOT95P280X100-5N = smd 1.25 x 0.6: 1 -1.25,0.95; 2 -1.25,0; 3 -1.25,-0.95; 4 1.25,-0.95; 5 1.25,0.95
SOT95P270X145-6N = smd 1.4 x 0.6: 1 -1.25,0.95; 2 -1.25,0; 3 -1.25,-0.95; 4 1.25,-0.95; 5 1.25,0; 6 1.25,0.95
LT1963AEQ25PBF = smd 1.067 x 2.286: 1 -3.404,-7.442; 2 -1.702,-7.442; 3 0,-7.442; 4 1.702,-7.442; 5 3.404,-7.442 | smd 10.668 x 8.89: 6 0,1.829
R0603 = smd 1 x 1.1: 1 -0.85,0; 2 0.85,0
1277ASH100MP2 = smd 0.9 x 2.8: 1 -1.4,0; 2 1.4,0
CHIPLED_0603 = smd 0.8 x 0.8: A 0,-0.75; C 0,0.75
CTI_OSC = drill 1 pad 2.184: GND 0,-9.5; NC 9.5,9.5; OUT -9.5,-9.5; REF 9.5,-9.5; VCC -9.5,9.5
SOIC127P600X170-9N = smd 1.525 x 0.65: 1 -2.712,1.905; 2 -2.712,0.635; 3 -2.712,-0.635; 4 -2.712,-1.905; 5 2.712,-1.905; 6 2.712,-0.635; 7 2.712,0.635; 8 2.712,1.905 | smd 2.6 x 3.1: 9 0,0
R0805 = smd 1.3 x 1.5: 1 -0.85,0; 2 0.85,0
R0805' = smd 1.3 x 1.5: 1 -0.95,0; 2 0.95,0
J502-ND-142-0701-871/876 = smd 5.08 x 2.286: 1 2.565,0; G@1 2.565,4.42; G@2 2.565,-4.42 | smd 5.08 x 2.286 bottom: G@3 2.565,4.42; G@4 2.565,-4.42
SOT23 = smd 1 x 1.4: 1 -0.95,-1.1; 2 0.95,-1.1; 3 0,1.1
PICO-PKG-TH-STD = drill 1: 1 -8.89,24.13; 2 -8.89,21.59; 3 -8.89,19.05; 4 -8.89,16.51; 5 -8.89,13.97; 6 -8.89,11.43; 7 -8.89,8.89; 8 -8.89,6.35; 9 -8.89,3.81; 10 -8.89,1.27; 11 -8.89,-1.27; 12 -8.89,-3.81; 13 -8.89,-6.35; 14 -8.89,-8.89; 15 -8.89,-11.43; 16 -8.89,-13.97; 17 -8.89,-16.51; 18 -8.89,-19.05; 19 -8.89,-21.59; 20 -8.89,-24.13; 21 8.89,-24.13; 22 8.89,-21.59; 23 8.89,-19.05; 24 8.89,-16.51; 25 8.89,-13.97; 26 8.89,-11.43; 27 8.89,-8.89; 28 8.89,-6.35; 29 8.89,-3.81; 30 8.89,-1.27; 31 8.89,1.27; 32 8.89,3.81; 33 8.89,6.35; 34 8.89,8.89; 35 8.89,11.43; 36 8.89,13.97; 37 8.89,16.51; 38 8.89,19.05; 39 8.89,21.59; 40 8.89,24.13
QFN50P500X500X100-33V2N = smd 0.9 x 0.3: 1 -2.45,1.75; 2 -2.45,1.25; 3 -2.45,0.75; 4 -2.45,0.25; 5 -2.45,-0.25; 6 -2.45,-0.75; 7 -2.45,-1.25; 8 -2.45,-1.75; 17 2.45,-1.75; 18 2.45,-1.25; 19 2.45,-0.75; 20 2.45,-0.25; 21 2.45,0.25; 22 2.45,0.75; 23 2.45,1.25; 24 2.45,1.75 | smd 0.3 x 0.9: 9 -1.75,-2.45; 10 -1.25,-2.45; 11 -0.75,-2.45; 12 -0.25,-2.45; 13 0.25,-2.45; 14 0.75,-2.45; 15 1.25,-2.45; 16 1.75,-2.45; 25 1.75,2.45; 26 1.25,2.45; 27 0.75,2.45; 28 0.25,2.45; 29 -0.25,2.45; 30 -0.75,2.45; 31 -1.25,2.45; 32 -1.75,2.45 | drill 0.33: PAD@1_1 -1,1; PAD@1_2 -1,0; PAD@1_3 -1,-1; PAD@2_1 0,1; PAD@2_2 0,0; PAD@2_3 0,-1; PAD@3_1 1,1; PAD@3_2 1,0; PAD@3_3 1,-1
GPS = drill 0.8 long: P$1 0,5.08; P$2 0,2.54; P$3 0,0; P$4 0,-2.54; P$5 0,-5.08

### Placement (x,y rotation side)
C1  91.58,19.97 90 top
C2  82.12,20.23 90 top
C3  80.24,20.23 90 top
C4  89.96,17.26 90 top
C5  88.26,17.69 90 top
C6  82.03,24.49 90 top
C7  80.15,24.49 90 top
C8  92.28,26.69 180 top
C9  95.38,28.44 270 top
C10  90.88,29.44 270 top
C11  92.53,29.44 270 top
C12  82.12,44.23 90 top
C13  80.47,44.23 90 top
C14  82.03,48.49 90 top
C15  80.42,48.49 90 top
C16  44.48,30.02 90 top
C17  46.7,29.39 90 top
C18  24.45,17.94 270 top
C19  10.16,32.86 0 top
C20  10.16,35.08 0 top
C21  9.21,20.8 270 top
C22  11.43,20.8 270 top
C23  41.78,31 90 top
C24  66.16,17.02 270 top
C25  68.21,17.03 270 top
C26  72.4,49.65 90 top
C27  75.01,28.16 180 top
C28  20.95,17.94 270 top
C29  29.53,34.77 180 top
C30  69.5,27.54 0 top
C31  69.51,25.51 0 top
C32  91.58,43.97 90 top
C33  84.34,29.45 270 top
C34  93.4,43.97 90 top
C35  89.96,41.26 90 top
C36  63.18,24.24 90 top
C37  60.92,24.24 90 top
C38  61.8,20.01 0 top
C39  88.26,41.69 90 top
C40  92.25,50.69 180 top
C41  95.38,52.44 270 top
C42  90.88,53.44 270 top
C43  92.53,53.44 270 top
C44  81.25,30.23 0 top
C45  84.34,53.45 270 top
C46  81.28,26.99 180 top
C47  81.28,28.51 180 top
C48  95.35,18.77 90 top
C49  98.28,27.14 180 top
C50  100.18,31.33 180 top
C51  100.17,33.35 180 top
C52  71.97,34.79 270 top
C53  98.28,24.49 0 top
C54  87.62,32.59 270 top
C55  89.22,32.59 90 top
C56  87.62,29.44 270 top
C57  81.25,54.23 0 top
C58  81.28,50.99 180 top
C59  81.28,52.51 180 top
C60  95.4,42.65 90 top
C61  98.28,51.14 180 top
C62  100.18,55.33 180 top
C63  100.17,57.35 180 top
C64  69.33,34.77 270 top
C65  98.28,48.49 0 top
C66  87.62,56.59 270 top
C67  89.22,56.59 90 top
C68  87.62,53.44 270 top
C69  93.22,19.97 90 top
C70  69,44 270 top
C71  75,44 90 top
C72  17.78,17.94 270 top
C73  36.51,31.27 90 top
C74  39.37,31.27 90 top
IC1  72,21 270 top
IC2  72,44 270 top
IC3  56.78,18.98 180 top
IC4  43.5,17.94 180 top
L1  92.4,40.32 180 top
L2  78.35,44.25 90 top
L3  77.94,48.82 90 top
L4  98.28,53.18 0 top
L5  20,23.65 0 top
L6  67.94,37.3 0 top
L7  70.95,37.3 0 top
L8  58.82,24.25 90 top
L9  73.98,37.3 0 top
L27  98.23,29.11 0 top
L30  78.35,20.25 90 top
L31  77.94,24.82 90 top
L32  92.4,16.32 180 top
LED1  51.12,49.05 0 top
LED2  43.5,49.05 0 top
LED3  40.96,49.05 0 top
LED4  48.58,49.05 0 top
OSC1  65.28,24.49 270 bottom
PS1  9.84,27.46 270 top
R1  85.97,29.44 90 top
R2  85.74,17.62 270 top
R3  85.97,53.44 90 top
R4  85.74,41.62 270 top
R5  90.88,56.59 270 top
R6  89.22,53.44 90 top
R7  92.53,56.59 270 top
R8  94.22,56.59 90 top
R9  95.36,45.7 270 top
R10  95.33,49.39 90 top
R11  62.06,17.86 0 top
R12  78.42,33.81 180 top
R13  68.11,32.23 180 top
R14  9.21,16.35 270 top
R15  35.24,24.92 270 top
R16  35.24,20.8 270 top
R17  6.99,16.35 90 top
R18  51.12,45.88 270 top
R19  43.5,45.88 270 top
R20  40.96,45.88 270 top
R21  48.58,45.56 270 top
R22  9.21,54.77 0 top
R23  13.97,50.64 180 top
R24  27.94,52.23 180 top
R25  10K  [R0805']  19.37,53.18 180 top
R26  65.09,32.23 0 top
R34  90.88,32.59 270 top
R35  89.22,29.44 90 top
R36  92.53,32.59 270 top
R37  94.22,32.59 90 top
R38  95.36,21.7 270 top
R39  95.33,25.39 90 top
SCK1  108,24 180 top
SCK2  107.8,48.36 180 top
T1  13.34,53.81 270 top
TR4  23.18,52.23 270 top
U1  26.99,50.32 270 bottom
U2  87.08,23.64 90 top
U3  87.08,47.64 90 top
U$2  25.72,37.62 270 bottom

### Tracks (layer width: path | path; a pad name or v marks a point on that pad's centre or on a via)
1_PPS  (1 unrouted)
  Top 0.61: U$2.P$1 19.68,37.62 18.1,39.21 18.1,41.4
10MHZ
  Top 0.406: R13.1 70.48,32.23 71.44,31.27 72.71,31.27 74.61,33.18 74.61,33.82 OSC1.OUT
  Top 0.61: OSC1.OUT 77.4,33.99 R12.2
10MHZ_REF  (via drill 0.4)
  Top 0.305: U2.29 83.86,23.39 v83.06,22.59 | U3.29 83.86,47.39 v83.06,46.59
  Top 0.406: L9.2 83.5,37.3 v84.14,36.67
  Signal 0.305: v83.06,46.59 84.06,46.59 85.09,45.56 85.09,36.67 85.09,23.65 84.14,22.7 83.17,22.7 v83.06,22.59 82.87,22.78
  Signal 0.406: v84.14,36.67 85.09,36.67
+3V3_ADF1  (via drill 0.4, 0.6)
  Top 0.305: U2.10 90,22.39 C1.2 | C1.2 C69.2 | R38.2 95.36,19.8 C48.2 | C1.2 91.44,20.69 90.93,20.69 90.75,20.87 v90.17,20.87 | v83.26,24.68 83.31,24.68 83.52,24.88 U2.26 | L31.2 76.73,25.67 76.2,26.19 76.2,27.92 C27.1
  Top 0.406: C51.2 C50.2 99.33,29.36 L27.2 99.08,28.47 98.73,28.11 97.71,28.11 97.42,27.82 C49.2 | R2.2 86.65,16.77 v86.89,17 | 86.9,16.99 86.9,14.77 87.22,14.45 92.58,14.45 93.22,15.08 93.22,16.29 L32.1
  Top 0.61: IC1.5 72.95,18.01 v73.03,17.94 73.34,18.26 75.56,18.26 76.71,19.4 L30.1 | R38.2 93.25,20.85 C69.2 | C49.2 96.53,26.24 R39.2 96.79,26.24 v97.16,25.88 | v75.88,29.68 75.88,28.08 C27.1
  Top 0.813: 86.9,16.99 v86.89,17
  Power 0.305: 90.34,21.04 v90.17,20.87
  Power 0.406: 90.28,20.75 v90.17,20.87 | 86.99,17.19 86.99,17.11 v86.89,17 | 77.15,23.65 82.23,23.65 v83.26,24.68
  Power 0.61: v73.03,17.94 75.25,17.94 76.2,18.89 | 76.2,18.89 76.2,18.57 79.38,15.4 85.28,15.4 v86.89,17 | v97.16,25.88 97.16,25.58 92.39,20.82 90.21,20.82 v90.17,20.87 v90.17,20.86 90.17,17.62 89.74,17.19 86.99,17.19 | 76.2,18.89 76.2,22.7 77.15,23.65 77.15,28.73 v75.88,29.68
+3V3_ADF2  (via drill 0.4, 0.5)  (1 unrouted)
  Top 0.305: C32.2 C34.2 93.31,44.74 93.92,44.74 94.25,45.07 95.14,45.07 | C60.2 95.36,43.8 R9.2 95.14,45.07 | 91.44,44.69 C32.2 | 95.14,45.07 96.38,45.07 v96.84,44.61 | v97.47,49.69 96.72,50.44 | U3.26 83.66,48.89 v83.4,48.63 | U3.10 89.97,46.39 90.49,45.88 90.52,45.88 C32.2 | v90.17,44.87 91.53,44.87 C32.2
  Top 0.406: C63.2 C62.2 99.33,53.35 L4.2 | R4.2 86.65,40.77 v86.89,41 | IC2.5 74.7,42.75 C71.1 76.76,43.05 | 76.76,43.05 78,43.05 L2.1 | L3.2 77,49.67 76.58,49.24 v76.58,48.73 76.58,43.23 76.76,43.05 | 86.9,40.99 86.9,38.87 87.55,38.22 92.51,38.22 93.27,38.98 93.27,40.31 L1.1
  Top 0.813: R10.2 96.53,50.24 96.72,50.44 C61.2 | 86.9,40.99 v86.89,41
  Power 0.305: v96.84,44.61 96.84,49.05 v97.47,49.69 | v83.4,48.63 81.28,48.73 | 81.28,48.73 v76.58,48.73 | 81.28,48.73 81.6,48.42 81.6,45.24 85.73,41.11 86.99,41.11 88.58,41.11 88.67,41.19
  Power 0.406: 88.67,41.19 90.28,42.8 90.28,44.75 v90.17,44.87 | 86.99,41.11 v86.89,41
+5V  (via drill 0.4, 0.8)  (2 unrouted)
  Top 0.406: IC2.1 72.95,46.55 73,46.6 72.62,46.98 71.48,46.98 71.05,46.56 IC2.3 69.3,45.25 C70.1 68.97,44.92 68.97,47.23 v69.53,47.78 | 71.05,22.45 IC1.3 70.92,22.38 | IC1.1 72.95,23.54 72.67,23.82 71.42,23.82 71.05,23.44 71.05,22.45 | C31.1 68.66,27.53 C30.1 66.92,27.54 v66.67,27.78 | R15.1 35.24,27.78 35.56,28.1 v41.91,28.1 | OSC1.VCC 55.78,25.98 56.83,24.92 58.64,24.92 L8.2 | 71.05,22.45 71.12,22.38 v69.85,22.38
  Top 0.61: 72.62,46.98 72.62,48.48 C26.1 | v41.91,28.1 41.78,28.22 C23.1 41.61,30.32 C74.1 C73.1 | U1.39 5.4,43.97 6.35,44.92 12.7,44.92 14.92,47.15 14.92,50.54 | R23.1 14.92,50.64 15.56,51.27 TR4.2 | U$2.P$5 30.8,34.13 C29.1
  Top 1.016: IC4.4 41.8,27.98 v41.91,28.1
  Power 0.406: v69.85,22.38 66.99,25.24 66.99,27.46 v66.67,27.78 58,27.78 55.78,30 OSC1.VCC 55.92,34.13 61.28,34.13 62.55,35.4 62.55,39.21 64.14,40.8 68.9,40.8 69.53,41.43 v69.53,47.78
  Power 1.016: 30.8,28.1 v41.91,28.1 46.99,28.1 | 30.8,28.1 24.13,28.1 14.92,37.3 7.3,37.3 5.4,39.21 5.4,41.4 | U$2.P$5 30.8,28.1
  Power 1.27: OSC1.VCC 51.93,33.99 50.16,32.23 50.16,31.27 46.99,28.1
+12V  (via drill 1.2)
  Top 0.406: C19.1 | C20.1 9.21,34.13
  Top 0.61: PS1.2 9.84,30.17 PS1.3 | 9.21,34.13 C19.1
  Top 1.016: C19.1 9.21,32.23 9.84,31.59 9.84,30.17
  Top 1.27: v7.62,33.81 9.21,33.81 9.21,34.13
  pour Power (isolate 0.5): 6.03,35.08 9.21,35.08 9.21,32.23 6.03,32.23
ADF1_CE  (via drill 0.4, 0.6)
  Top 0.305: U2.4 86.83,20.04 85.82,18.94 85.69,18.8 R2.1 85.41,18.13 85.41,17.94 84.14,16.67 v83.5,16.67 | v62.55,51.59 v62.55,42.07
  Signal 0.305: v62.55,42.07 63.5,42.07 67.94,37.62 67.94,32.86 67.63,32.54 67.63,27.14 74.3,20.48 74.3,18.57 76.52,16.35 83.19,16.35 v83.5,16.67 | v62.55,51.59 61.59,52.55 41.91,52.55 40.97,53.48 U1.16
ADF1_LD  (via drill 0.3, 0.6)
  Top 0.254: U2.25 83.84,25.39 83.55,25.68 83.55,25.69 v83.41,25.83
  Top 0.305: v60.64,49.69 v60.64,43.02
  Top 0.406: v68.9,29.68 72.39,29.68 73.98,31.27 v75.25,31.27
  Signal 0.305: v60.64,49.69 39.05,49.69 35.89,52.85 U1.14 | v60.64,43.02 61.59,43.02
  Signal 0.406: 61.59,43.02 63.82,43.02 68.9,37.94 v68.9,29.68 | v75.25,31.27 80.96,31.27 81.92,30.32 81.92,27.32 v83.41,25.83
ADF1_LE  (via drill 0.4)
  Top 0.305: U2.3 86.33,20.44 85.41,19.52 85.19,19.52 84.71,19.04 84.71,18.51 v83.97,17.77
  Signal 0.305: v83.97,17.77 82.08,17.77 78.42,21.43 74.93,21.43 69.85,26.51 69.85,38.26 66.04,42.07 | 15.57,45.55 U1.6
  Signal 0.406: 15.57,45.55 17.14,43.97 64.14,43.97 66.04,42.07
ADF2_CE  (via drill 0.4)
  Top 0.305: U3.4 86.83,44.04 85.82,42.94 85.69,42.8 | 85.69,42.8 R4.1 | 85.69,42.8 85.69,42.35 84.45,41.11 84.45,40.48 v84.14,40.16 | v65.09,51.59 65.09,38.58 v64.77,38.26
  Signal 0.305: v65.09,51.59 65.09,52.23 63.18,54.13 44.77,54.13 43.51,55.39 U1.17
  Power 0.305: v64.77,38.26 82.23,38.26 v84.14,40.16
ADF2_LD  (via drill 0.4)  (1 unrouted)
  Top 0.305: U3.25 83.8,49.39 v83.5,49.69
  Signal 0.305: v83.5,49.69 80.96,49.69 80.64,50.01 66.99,50.01 66.67,49.69 62.23,49.69 61.59,50.96 39.69,50.96 38.42,52.23 38.42,59.18
ADF2_LE  (via drill 0.4)
  Top 0.305: U3.3 86.33,44.28 85.83,43.78 85.14,43.78 84.71,43.35 84.71,42.18 82.37,39.84 79.38,39.84 v78.11,41.11
  Signal 0.305: 75.88,41.11 v78.11,41.11 | 30.81,50.63 U1.12
  Signal 0.406: 30.81,50.63 32.7,48.73 66.36,48.73 73.98,41.11 75.88,41.11
ADF_CLK  (via drill 0.4)  (1 unrouted)
  Top 0.305: U3.1 84.08,45.19 83.34,44.44 83.34,42.87 82.91,42.44 82.88,42.44 82.51,42.07 v81.92,42.07
  Top 0.406: v83.82,20.48 84.14,20.48 84.45,21.11 85.25,21.11 U2.1 | v70.48,40.48 72.07,38.89 v73.03,38.89
  Signal 0.305: 79.06,23.34 77.79,24.61 76.52,24.61 74.93,26.19 73.66,26.19 71.75,28.1 71.75,37.62 v73.03,38.89 | 23.19,47.77 U1.9 | 80.96,39.21 81.6,39.84 81.6,41.75 v81.92,42.07
  Signal 0.406: 79.06,23.34 81.92,20.48 v83.82,20.48 | 23.19,47.77 25.08,45.88 65.09,45.88 v70.48,40.48 | v73.03,38.89 80.64,38.89 80.96,39.21
ADF_MOSI  (via drill 0.4)  (1 unrouted)
  Top 0.305: U2.2 85.83,20.58 85.72,20.48 85.41,20.48 84.14,19.21 v83.82,19.21 | U3.2 85.83,44.52 85.65,44.34 84.43,44.34 84.07,43.98 84.07,42.69 83.01,41.62 82.98,41.62 82.47,41.11 v80.33,41.11
  Signal 0.305: v83.82,19.21 81.92,19.21 78.74,22.38 75.25,22.38 70.8,26.83 70.8,38.58 72.39,40.16 73.66,40.16 79.38,40.16 v80.33,41.11 | 28.27,49.99 U1.11
  Signal 0.406: 28.27,49.99 30.48,47.78 66.04,47.78 73.66,40.16
ALARM_OUT  (via drill 0.6, 1)
  Top 0.61: v33.34,52.23 R24.1
  Power 0.61: v33.34,52.23 33.34,48.42 33.02,48.1 v7.3,48.1
  pour Power: 5.71,50.01 5.71,46.83 8.89,46.83 8.89,50.01
ALARM_PIN
  Top 0.61: U1.1 2.86,57.62 4.13,56.35 7.62,56.35 8.26,55.72 8.26,54.87 R22.1
AVDD
  Top 0.406: IC3.2 59.92,18.98 C38.1
  Top 0.61: L8.1 C37.1 | C37.1 C36.1 | C38.1 60.95,23.36 C37.1
FREQ_COUNT_IN  (via drill 0.4)
  Top 0.406: v81.6,33.81 R12.1
  Signal 0.406: v64.45,34.45 55.88,43.02 31.43,43.02 30.96,42.54 30.81,42.4 30.8,42.38 U1.29
  Power 0.406: v64.45,34.45 69.85,34.45 72.07,36.67 78.74,36.67 v81.6,33.81
GND  (via drill 0.4, 0.8)  (6 unrouted)
  Top 0.305: U2.27 85.83,24.39 U2.PAD@3_1 | U2.31 85.83,22.39 U2.PAD@1_1 | U2.21 86.83,24.89 U2.PAD@3_2 | U2.18 88.33,24.89 U2.PAD@3_3 | U2.11 88.33,22.89 U2.PAD@1_3 88.83,21.89 | U2.9 88.83,21.89 | U2.8 88.83,21.89 | U3.27 85.83,48.39 U3.PAD@3_1 | U3.31 85.83,46.39 U3.PAD@1_1 | U3.21 86.83,48.89 U3.PAD@3_2 | U3.18 88.33,48.89 U3.PAD@3_3 | U3.11 88.33,46.89 U3.PAD@1_3 88.83,45.89 | U3.9 88.83,45.89 | U3.8 88.83,45.89 | C10.1 C11.1 | 93.67,30.29 95.27,30.29 v95.31,30.34 | C42.1 C43.1 | 93.67,54.29 95.27,54.29 v95.31,54.34 | R16.2 35.24,18.59 v35.49,18.34 | C15.2 C14.2 | C7.2 C6.2 | v71.97,44.16 71.97,41.65 71.75,41.43 69.53,41.43 69.22,41.75 69.22,42.84 C70.2 | C62.1 102.13,55.33 v102.14,55.34 | C63.1 102.06,57.35 v102.08,57.32
  Top 0.406: C4.1 89.91,15.72 v89.93,15.31 | C5.1 88.26,15.69 v88.22,15.69 | v79.95,18.3 80.47,19.24 C3.1 C2.1 | v79.25,25.48 79.35,25.44 C7.2 | v79.4,27 v79.4,26.99 C46.2 | v79.39,28.49 79.39,28.51 C47.2 | v79.36,30.2 79.36,30.23 C44.1 | C33.1 84.34,31.4 v84.36,31.4 | v87.68,34.71 87.68,33.44 C54.1 | v92.5,34.48 92.5,33.44 R36.1 | 93.67,30.29 C11.1 | v94.01,26.68 v94.01,26.69 C8.1 | v95.31,30.34 95.31,29.29 C9.1 | v100.21,27.13 v100.21,27.14 C49.1 | v102.16,31.29 101.82,31.28 C50.1 101.03,33.02 C51.1 | C48.1 95.42,17.06 v95.41,16.81 | C69.1 93.22,18.12 v93.27,18.02 | C1.1 91.58,18.12 v91.59,18 | C35.1 89.91,39.72 v89.93,39.31 | C39.1 88.26,39.69 v88.22,39.69 | v79.95,42.3 80.47,43.24 C13.1 C12.1 | v79.35,49.33 v79.35,49.34 C15.2 | v79.4,51 v79.4,50.99 C58.2 | v79.39,52.49 79.39,52.51 C59.2 | v79.36,54.2 79.36,54.23 C57.1 | C45.1 84.34,55.4 v84.36,55.4 | v87.68,58.71 87.68,57.44 C66.1 | v92.5,58.48 92.5,57.44 R7.1 | 93.67,54.29 C43.1 | v94.09,50.71 94.01,50.69 C40.1 | v95.31,54.34 95.31,53.29 C41.1 | v100.21,51.13 v100.21,51.14 C61.1 | C60.1 95.42,41.06 v95.41,40.73 | C34.1 93.45,42.25 v93.43,42.1 | C32.1 91.58,42.12 v91.56,42.13 | 74.95,45 C71.2 74.97,44.98 v74.97,46.19 | IC2.2 72,44.19 v71.97,44.16 | 68.9,42.95 C70.2 | IC1.2 72,21.2 v71.98,21.18 | v66.14,15.05 66.14,16.15 C24.2 | v68.23,15.05 68.23,16.16 C25.2 | C38.2 63.56,20.01 v63.67,20.12 | IC3.3 59.37,19.93 v59.38,19.94 | IC3.6 v54.16,18.03 v54.16,18.02 | C30.2 70.36,27.53 C31.2 70.36,24.8 69.53,23.97 67.76,22.38 v67.73,21.72 | C64.2 71.94,33.91 | 71.94,33.91 C52.2 | 71.94,33.91 71.94,32.99 72.07,32.86 72.7,32.86 v72.76,32.8 | R26.1 63.29,32.23 v63.24,32.17
  Top 0.61: C27.2 74.06,29.26 v73.89,29.43 | C26.2 72.4,52.03 v72.54,52.18 | IC4.3 43.5,19.43 v43.37,19.29 | C20.2 12.18,35.08 v12.65,34.92 | C19.2 12.49,32.86 v12.65,33.02 | PS1.1 12.88,30.17 v13.01,30.3 | R17.1 6.99,14.02 v6.94,13.97 | C21.2 7.73,19.84 v7.57,19.68 | C18.2 24.45,15.08 24.13,14.76 23.46,14.76 v23.41,14.81 | v20.87,14.81 20.87,16.46 C28.2 | v17.7,14.81 17.7,16.46 C72.2 | C73.2 36.51,33.52 v36.45,33.58 | C74.2 39.37,33.52 v39.3,33.58 | C23.2 41.78,33.2 v41.84,33.26 | C17.2 46.7,31.9 v46.61,31.99 | C16.2 44.48,32.54 v44.38,32.63 | C37.2 60.92,26.5 v60.96,26.53 | C36.2 v63.18,26.53 | LED2.C LED4.C LED1.C | LED2.C LED3.C | 46.04,49.8 46.04,49.69 | 46.04,49.69 U1.23 | v10.22,52.74 12.23,52.74 T1.2 | LED2.C 45.92,49.8 46.04,49.69 | C29.2 28.58,37.3 U$2.P$4
  Top 1.016: C33.1 R1.2 C56.1 | C45.1 R3.2 C68.1
  Power 0.305: SCK1.G@4 105.44,43.74 SCK2.G@3
  other vias: 8.32,12.17 103.77,43.93 103.77,52.82 106.31,43.93 14.37,12.17 20.64,12.17 30.64,12.17 35.32,12.17 51.12,12.17 56.12,12.17 26.19,12.17 59.77,61.7 64.77,61.7 69.77,61.7 74.77,61.7 79.77,61.7 84.77,61.7 89.77,61.7 94.77,61.7 99.77,61.7 106.31,52.82 59.77,12.24 64.77,12.24 69.77,12.24 74.77,12.24 79.77,12.24 84.77,12.24 89.77,12.24 94.77,12.24 99.77,12.24 104.77,12.24 1.97,34.65 1.58,48.03 1.52,55.97 106.76,19.7 104.08,28.43 106.45,28.43 106.45,32.06 106.45,36.06 106.45,40.06 45.21,19.29 41.53,19.29 47.05,19.29 39.68,19.29 56.74,61.72 104.08,19.7 2.28,21.63 1.65,13.38 43.49,23.1 10.58,27.49 9.11,27.47 45.21,17.39 41.53,17.39 47.05,17.39 39.68,17.39 39.68,15.48 41.59,15.48 43.49,15.48 45.08,15.48 46.99,15.48 39.68,13.58 41.59,13.58 43.49,13.58 45.08,13.58 46.99,13.58 1.97,29.89 1.97,25.76 1.97,18.14 106.43,60.12 106.43,55.99 43.3,17.39
  pour Power (isolate 0.5, rank 2): 0,63 104,63 104,62 109,62 109,10 5,10 5,11 0,11
  pour RFEarth (isolate 0.5): 0,11 6,11 6,10 109,10 109,62 104,62 104,63 0,63
GPS_RX
  Signal 0.61: U$2.P$2 23.18,35.72 25.72,33.18 33.66,33.18 38.42,37.94 U1.26
GPS_TX
  Signal 0.61: U$2.P$3 25.72,35.72 26.67,34.77 33.02,34.77 35.88,37.62 U1.27
I2C_SCL
  Top 0.305: IC3.5 55.44,18.89 53.98,18.89 52.07,20.8 52.07,35.4 54.93,38.26 54.93,56.67 52.41,59.2 52.41,59.21 U1.20
I2C_SDA  (1 unrouted)
  Top 0.305: U1.19 48.58,60.48 48.9,60.8 53.02,60.8 55.56,58.26 55.56,37.94 52.7,35.08 52.7,21.43 54.29,19.84 55.45,19.84 IC3.4
LED_ADF1_LOCK
  Top 0.61: R19.2 U1.24
LED_ADF2_LOCK
  Top 0.61: R20.2 U1.25
LED_GPS_DISC
  Top 0.61: U1.21 R18.2
LED_GPS_LOCK
  Top 0.61: U1.22 R21.2
N$1
  Top 0.305: U3.19 87.83,50.74 88.28,51.19 89.97,51.19 90.22,51.44 90.28,51.44 90.88,52.04 C42.2 C43.2
N$2
  Top 0.305: U2.19 87.83,26.74 88.28,27.19 89.97,27.19 90.22,27.44 90.28,27.44 90.88,28.04 C10.2 C11.2
N$3
  Top 0.305: U3.23 85.83,50.74 85.12,51.44 84.62,51.44 84.33,51.74 84.33,52.58 C45.2 83.69,52.6 83.26,53.03 83.26,53.66 82.67,54.25 82.12,54.25 C57.2
N$4
  Top 0.305: U2.23 85.83,26.74 85.12,27.44 84.62,27.44 84.33,27.74 84.33,28.58 C33.2 83.69,28.6 83.26,29.03 83.26,29.66 82.67,30.25 82.12,30.25 C44.2
N$5
  Top 0.305: U3.24 85.33,50.39 85.03,50.69 83.72,50.69 83.38,51.04 82.19,51.04 C58.1 82.14,52.5 C59.1
N$6
  Top 0.305: U3.22 86.33,51.24 85.97,51.59 R3.1
N$7  (1 unrouted)
  Top 0.305: U3.12 90.03,47.39 90.33,47.09 90.68,46.99 | R9.1 97.41,46.77
  Top 1.016: 90.97,46.7 90.68,46.99
N$8
  Top 0.305: U2.24 85.33,26.39 85.03,26.69 83.72,26.69 83.38,27.04 82.19,27.04 C46.1 82.14,28.5 C47.1
N$9
  Top 0.305: 90.68,48.37 90.2,47.89 U3.13 | R10.1 96.59,48.54 96.64,48.49
  Top 1.016: 90.68,48.37 91.08,48.49 96.64,48.49 C65.1 97.47,48.49
N$10  (via drill 0.4)
  Top 0.305: R6.2 C67.1 C66.2 v86.22,55.74 | U3.7 88.33,44.34 v88.97,43.99
  Power 0.305: v88.97,43.99 85.12,43.99 84.38,44.74 84.38,53.89 v86.22,55.74
N$11
  Top 0.305: U3.20 87.33,51.24 87.62,51.54 C68.2 R6.1
N$12
  Top 0.305: R5.1 C67.2
N$13
  Top 0.305: U2.6 87.83,19.7 88.28,19.24 88.28,18.56 C5.2 | L32.2 91.55,16.51 C4.2
  Top 0.61: C5.2 C4.2
N$14
  Top 0.305: U2.32 83.72,21.89 82.97,21.14 82.19,21.14 C2.2 | 80.45,21.1 C3.2
  Top 0.406: L30.2 78.36,21.08 C3.2 C2.2
N$15
  Top 0.305: R5.2 R7.2 R8.1
N$16  (via drill 0.4, 0.6)
  Top 0.305: v94.22,58.88 R8.2 | U3.5 87.33,43.35 v87,43.02
  Signal 0.305: v87,43.02 87,44.61 87.95,45.56 89.53,45.56 90.49,46.51 90.49,51.91 94.3,55.72 94.3,58.8 v94.22,58.88
N$17
  Top 0.305: U2.22 86.33,27.24 85.97,27.59 R1.1
N$18  (1 unrouted)
  Top 0.305: U2.12 90.03,23.39 90.33,23.09 90.68,22.99 | R38.1 97.41,22.77
  Top 1.016: 90.97,22.7 90.68,22.99
N$19
  Top 0.305: 90.68,24.37 90.2,23.89 U2.13 | R39.1 96.59,24.54 96.64,24.49
  Top 1.016: 90.68,24.37 91.08,24.49 96.64,24.49 C53.1 97.47,24.49
N$20
  Top 0.406: IC3.1 59.6,18.03 60.01,17.62 60.97,17.62 R11.1
N$21
  Top 0.61: R23.2 13.12,51.38 13.65,51.91 13.97,51.91 14.29,52.23 14.29,53.67 T1.3 15.24,53.81 15.88,53.18 R25.2
N$22
  Top 0.305: U3.6 87.83,43.7 88.28,43.24 88.28,42.56 C39.2 | L1.2 91.55,40.51 C35.2
  Top 0.61: C39.2 C35.2
N$23
  Top 0.305: U3.32 83.72,45.89 82.97,45.14 82.19,45.14 C12.2 | 80.45,45.1 C13.2
  Top 0.406: L2.2 78.36,45.08 C13.2 C12.2
N$24
  Top 0.305: U3.28 83.17,47.89 82.92,47.64 C14.1 | C15.1 79.19,47.64 78.87,47.97 L3.1 | L3.1
  Top 0.61: C15.1 C14.1
N$25
  Top 0.305: U3.17 U3.16 90.62,49.39 91.12,49.89 91.12,50.39 C40.2 91.42,51.53 91.56,51.67 95.3,51.67 C41.2
  Top 0.406: L4.1 96.89,53.1 C41.2
N$26
  Top 0.406: R26.2 R13.2 67.09,32.39 L6.1
N$27
  Top 0.61: LED1.A R18.1
N$28
  Top 0.61: R22.2 T1.1
N$29
  Top 0.61: R16.1 35.24,23.02 | 35.24,23.02 R15.2 | IC4.5 38.24,25.38 37.47,24.61 37.47,23.34 37.15,23.02 35.24,23.02
N$31
  Top 0.61: R14.1 R17.2 6.03,18.15 6.03,22.06 7.94,23.97 PS1.5
N$32
  Top 0.406: 68.26,18.08 68.41,18.08 C25.1 68.2,17.87 C24.1 R11.2
  Top 0.61: OSC1.REF 72.17,14.99 70.8,16.35 70.8,16.98 69.85,17.94 68.27,17.94 C25.1
N$33
  Top 0.61: PS1.6 C21.1
N$34
  Top 0.61: PS1.7 10.48,23.65 11.43,22.7 C22.1
N$35
  Top 0.61: PS1.8 11.75,24.29 12.38,23.65 13.02,23.65 13.34,23.34 13.34,20.48 12.7,19.84 C22.2
  Top 1.016: 13.02,23.65 L5.1
N$36  (via drill 1)
  Top 0.406: IC4.2 45.86,25.38 46.04,25.56
  Top 0.61: C18.1 23.81,19.34 C28.1 C72.1 15.69,19.34 15.24,18.89 15.24,16.03 14.61,15.4 9.31,15.4 R14.2 | 46.04,25.56 46.04,27.78 C17.1
  Top 1.016: 23.81,19.34 23.91,19.43 24.13,19.66 24.13,23.65 L5.2 | IC4.1 IC4.2
  Top 1.676: 46.04,25.56 46.04,23.34 v46.35,23.02 | v30.48,23.02 26.99,19.52 24,19.52 23.91,19.43
  Power 1.676: v46.35,23.02 46.35,24.92 45.72,25.56 32.07,25.56 30.48,23.97 v30.48,23.02
N$37
  Top 0.61: LED2.A R19.1
N$38
  Top 0.61: LED3.A R20.1
N$39
  Top 0.61: LED4.A R21.1
N$41
  Top 0.61: L6.2 69.53,37.3 | 69.53,37.3 L7.1 | C64.1 69.53,35.61 69.53,37.3
N$42
  Top 0.61: R25.1 TR4.1
N$43
  Top 0.61: L9.1 L7.2 71.81,35.64 C52.1
N$46  (via drill 0.4)
  Top 0.305: R35.2 C55.1 C54.2 v86.22,31.74 | U2.7 88.33,20.34 v88.97,19.99
  Power 0.305: v88.97,19.99 85.12,19.99 84.38,20.74 84.38,29.89 v86.22,31.74
N$47
  Top 0.305: U2.20 87.33,27.24 87.62,27.54 C56.2 R35.1
N$48
  Top 0.305: R34.1 C55.2
N$49
  Top 0.305: R34.2 R36.2 R37.1
N$50  (via drill 0.4)
  Top 0.305: v94.22,34.88 R37.2 | U2.5 87.33,19.22 v87,18.89
  Signal 0.305: v87,18.89 87,20.16 90.17,23.34 90.17,30.83 v94.22,34.88
N$73
  Top 0.305: U2.28 83.17,23.89 82.92,23.64 C6.1 | C7.1 79.19,23.64 78.87,23.97 L31.1 | L31.1
  Top 0.61: C7.1 C6.1
N$78
  Top 0.305: U2.17 U2.16 90.62,25.39 91.12,25.89 91.12,26.39 C8.2 91.42,27.53 91.56,27.67 95.3,27.67 C9.2
  Top 0.406: L27.1 96.89,29.11 C9.2
N$101
  Top 1.016: C53.2 105.44,24.49 SCK1.1
OUTPUT
  Top 0.813: 104.18,48.41 SCK2.1
  Top 1.016: C65.2 104.18,48.49 104.18,48.41
SWITCH
  Top 0.61: TR4.3 R24.2

### Text on the board
tNames: PLL1 | PLL2 | GPS | LOCK | V 1.1
tDocu: G1YFG